# EAGLE board display-r2 (EAGLE 6.6.0), part 1 of 3
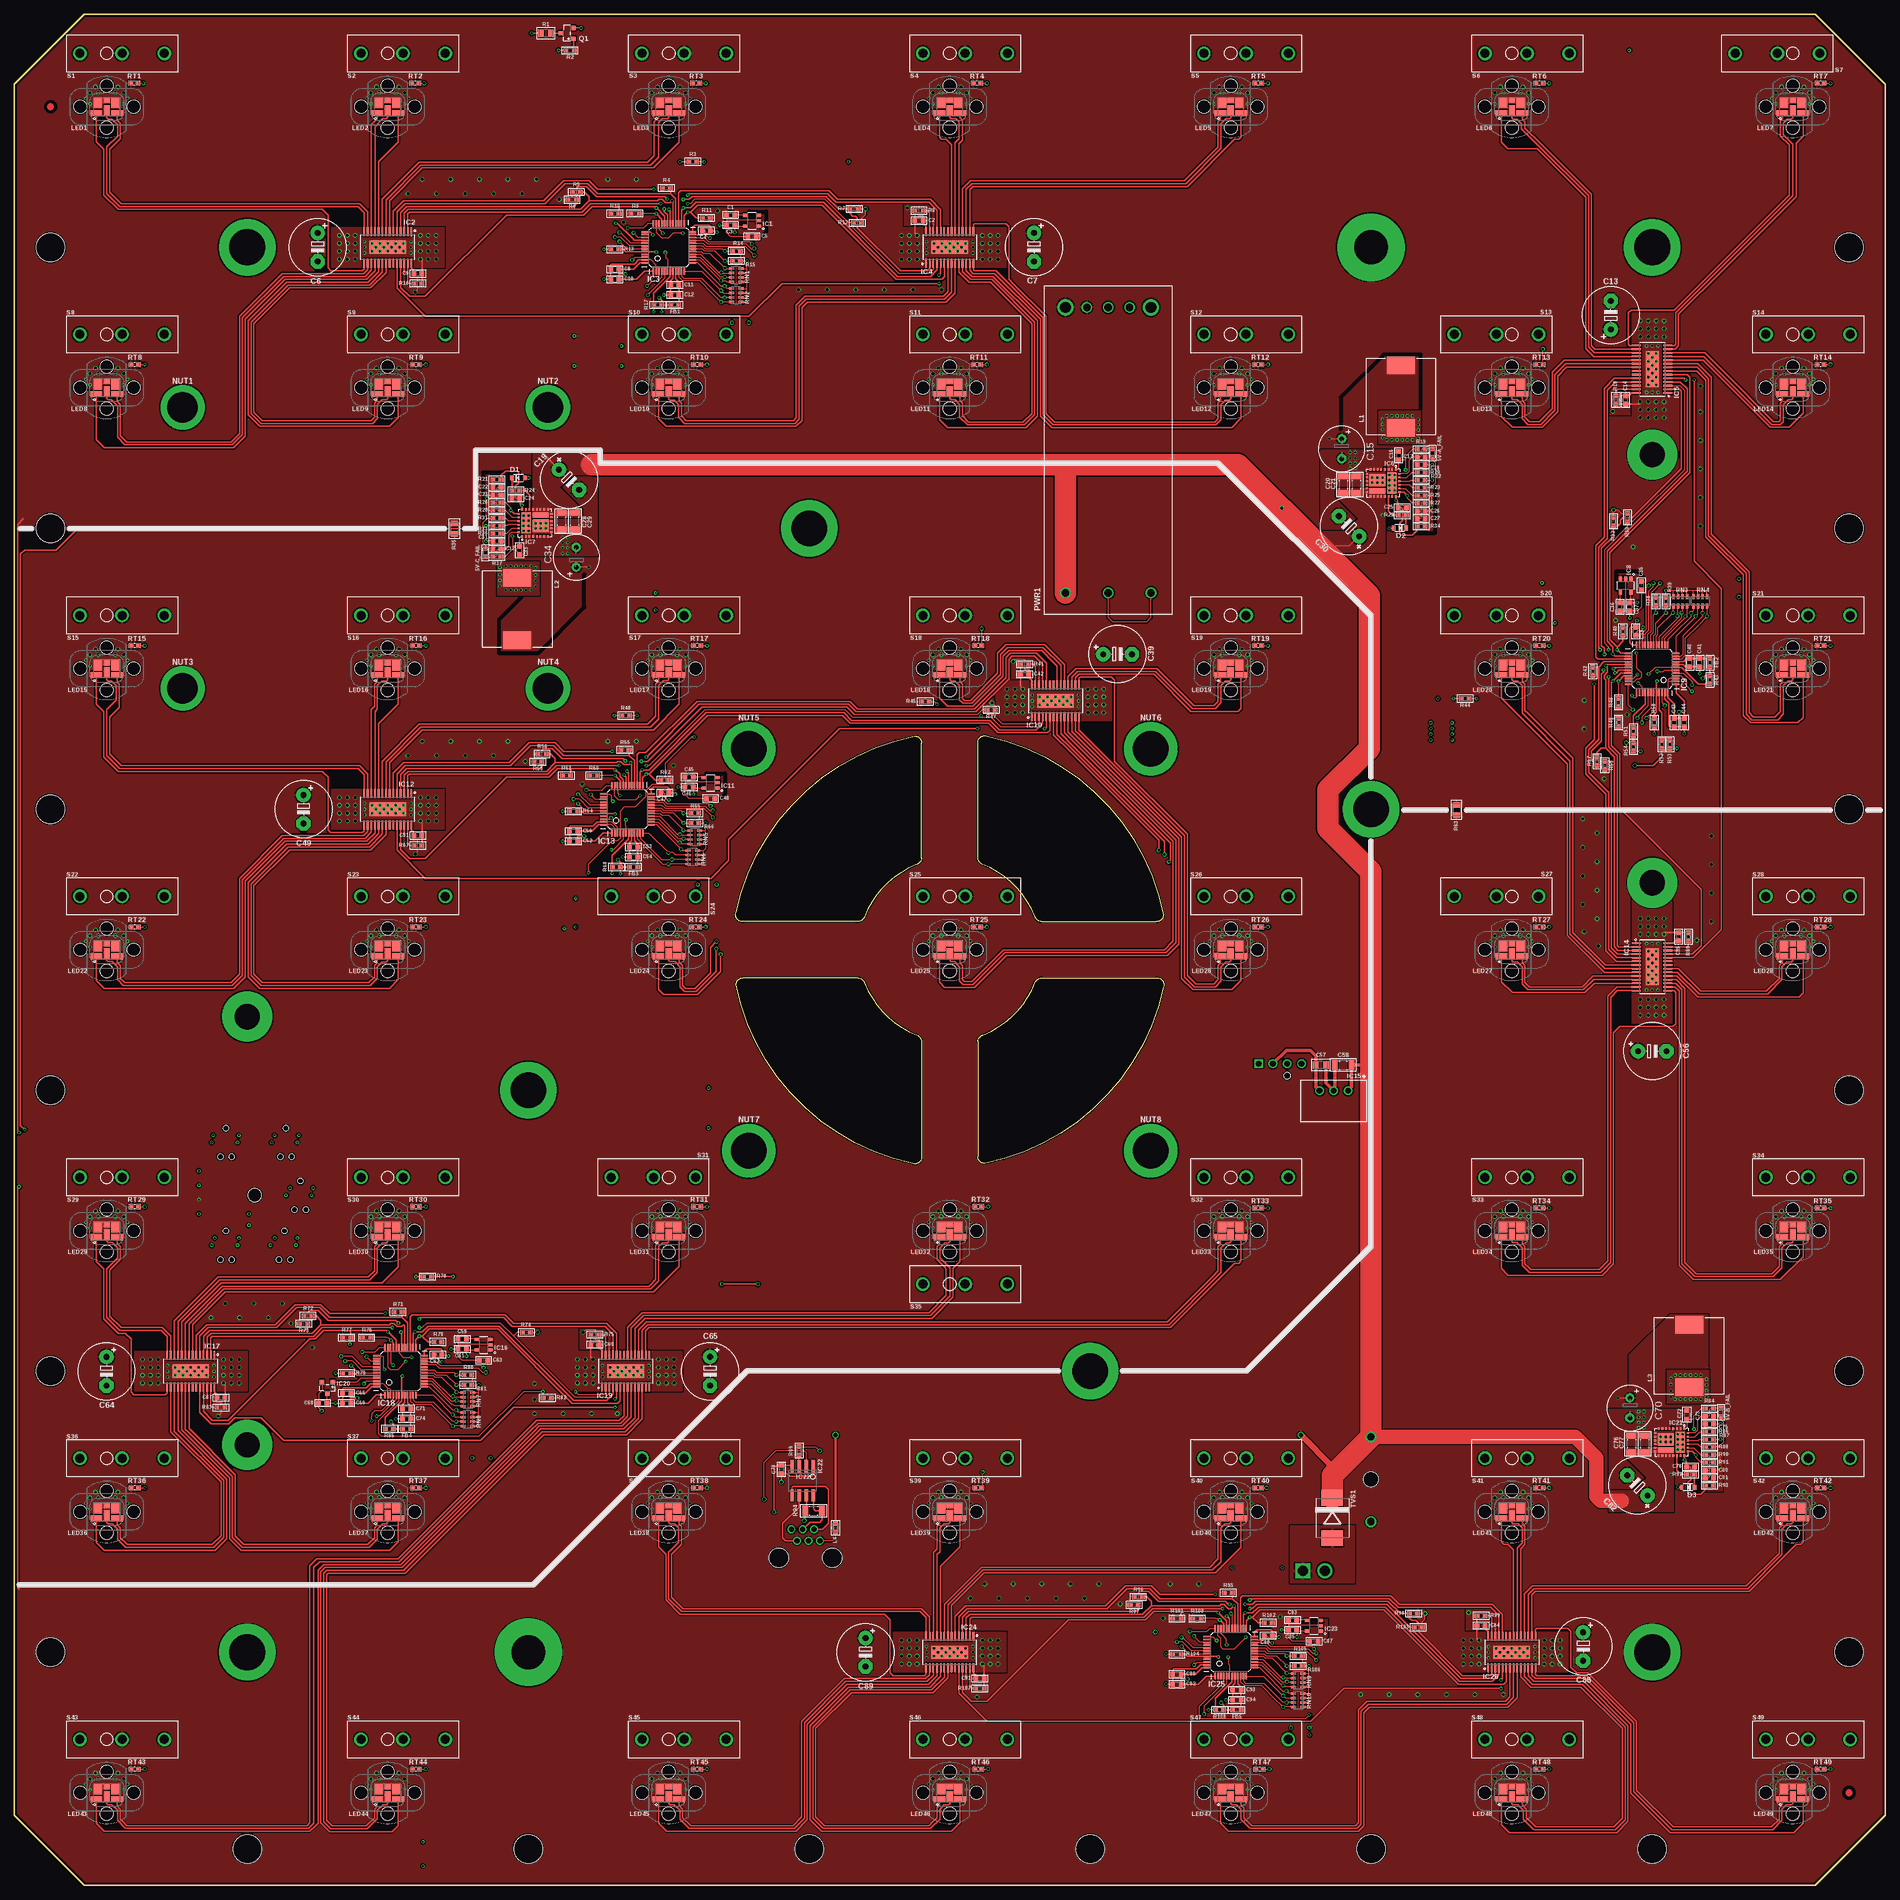
[diagram p9: board, top side]
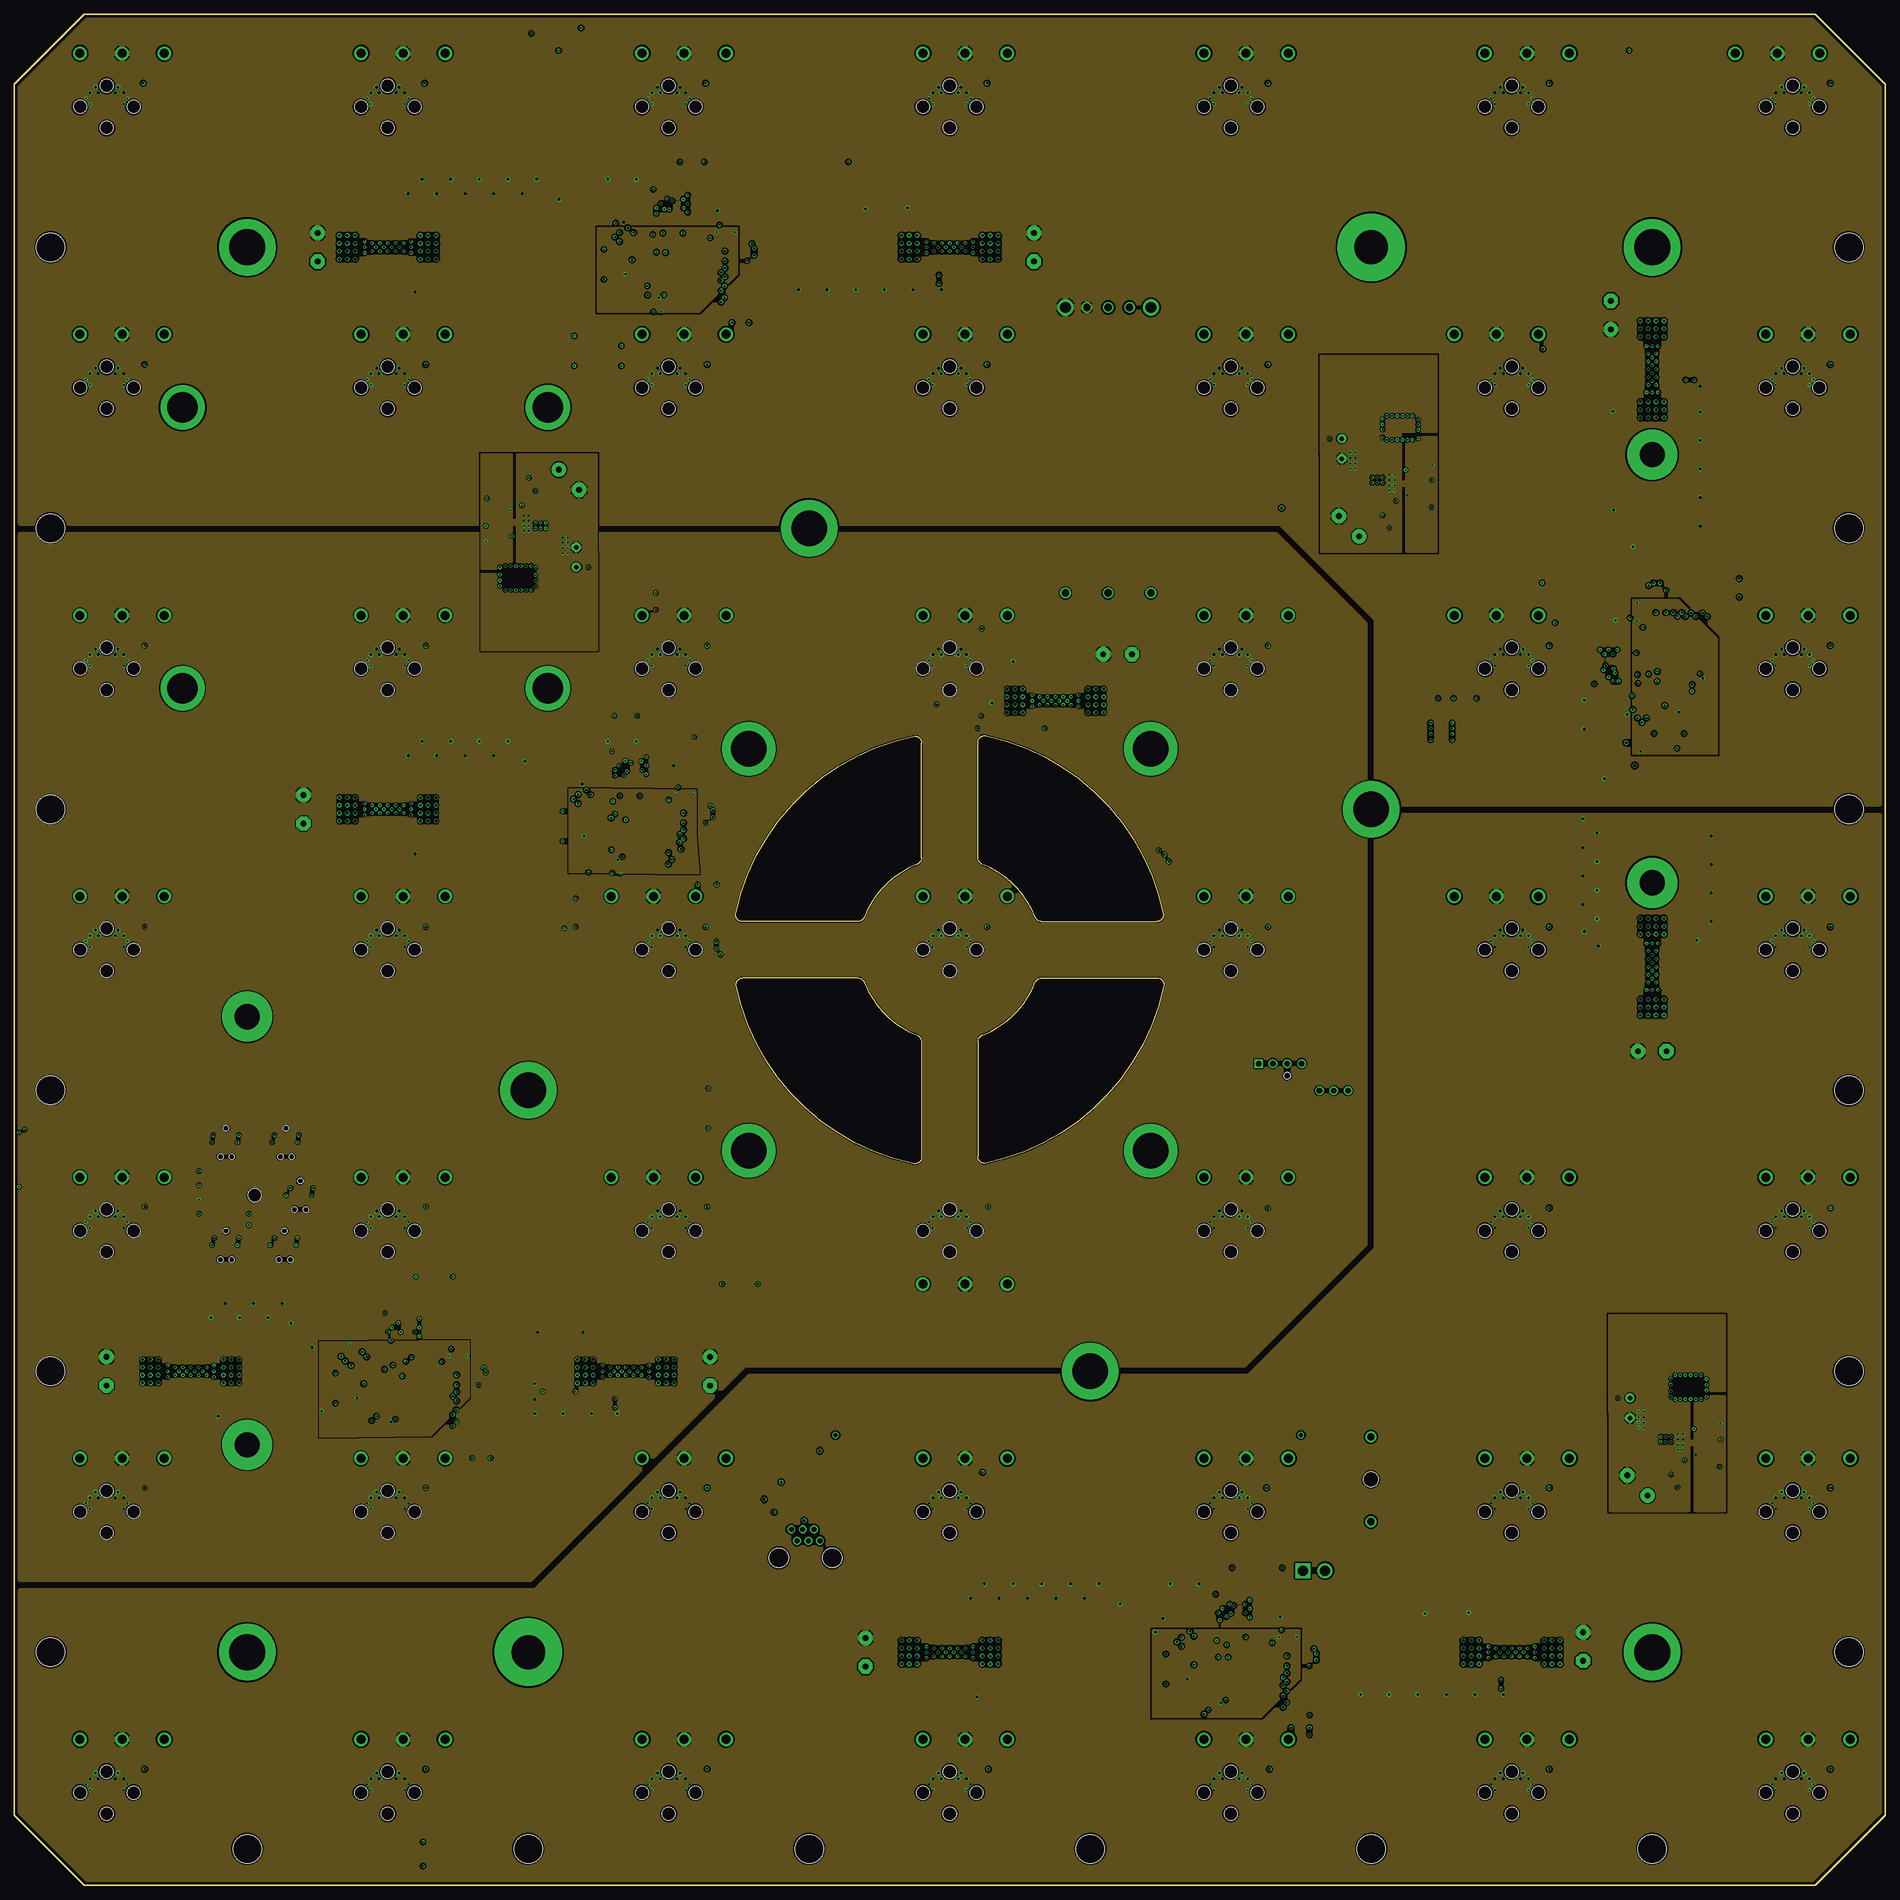
[diagram p10: board, inner layer Route2]
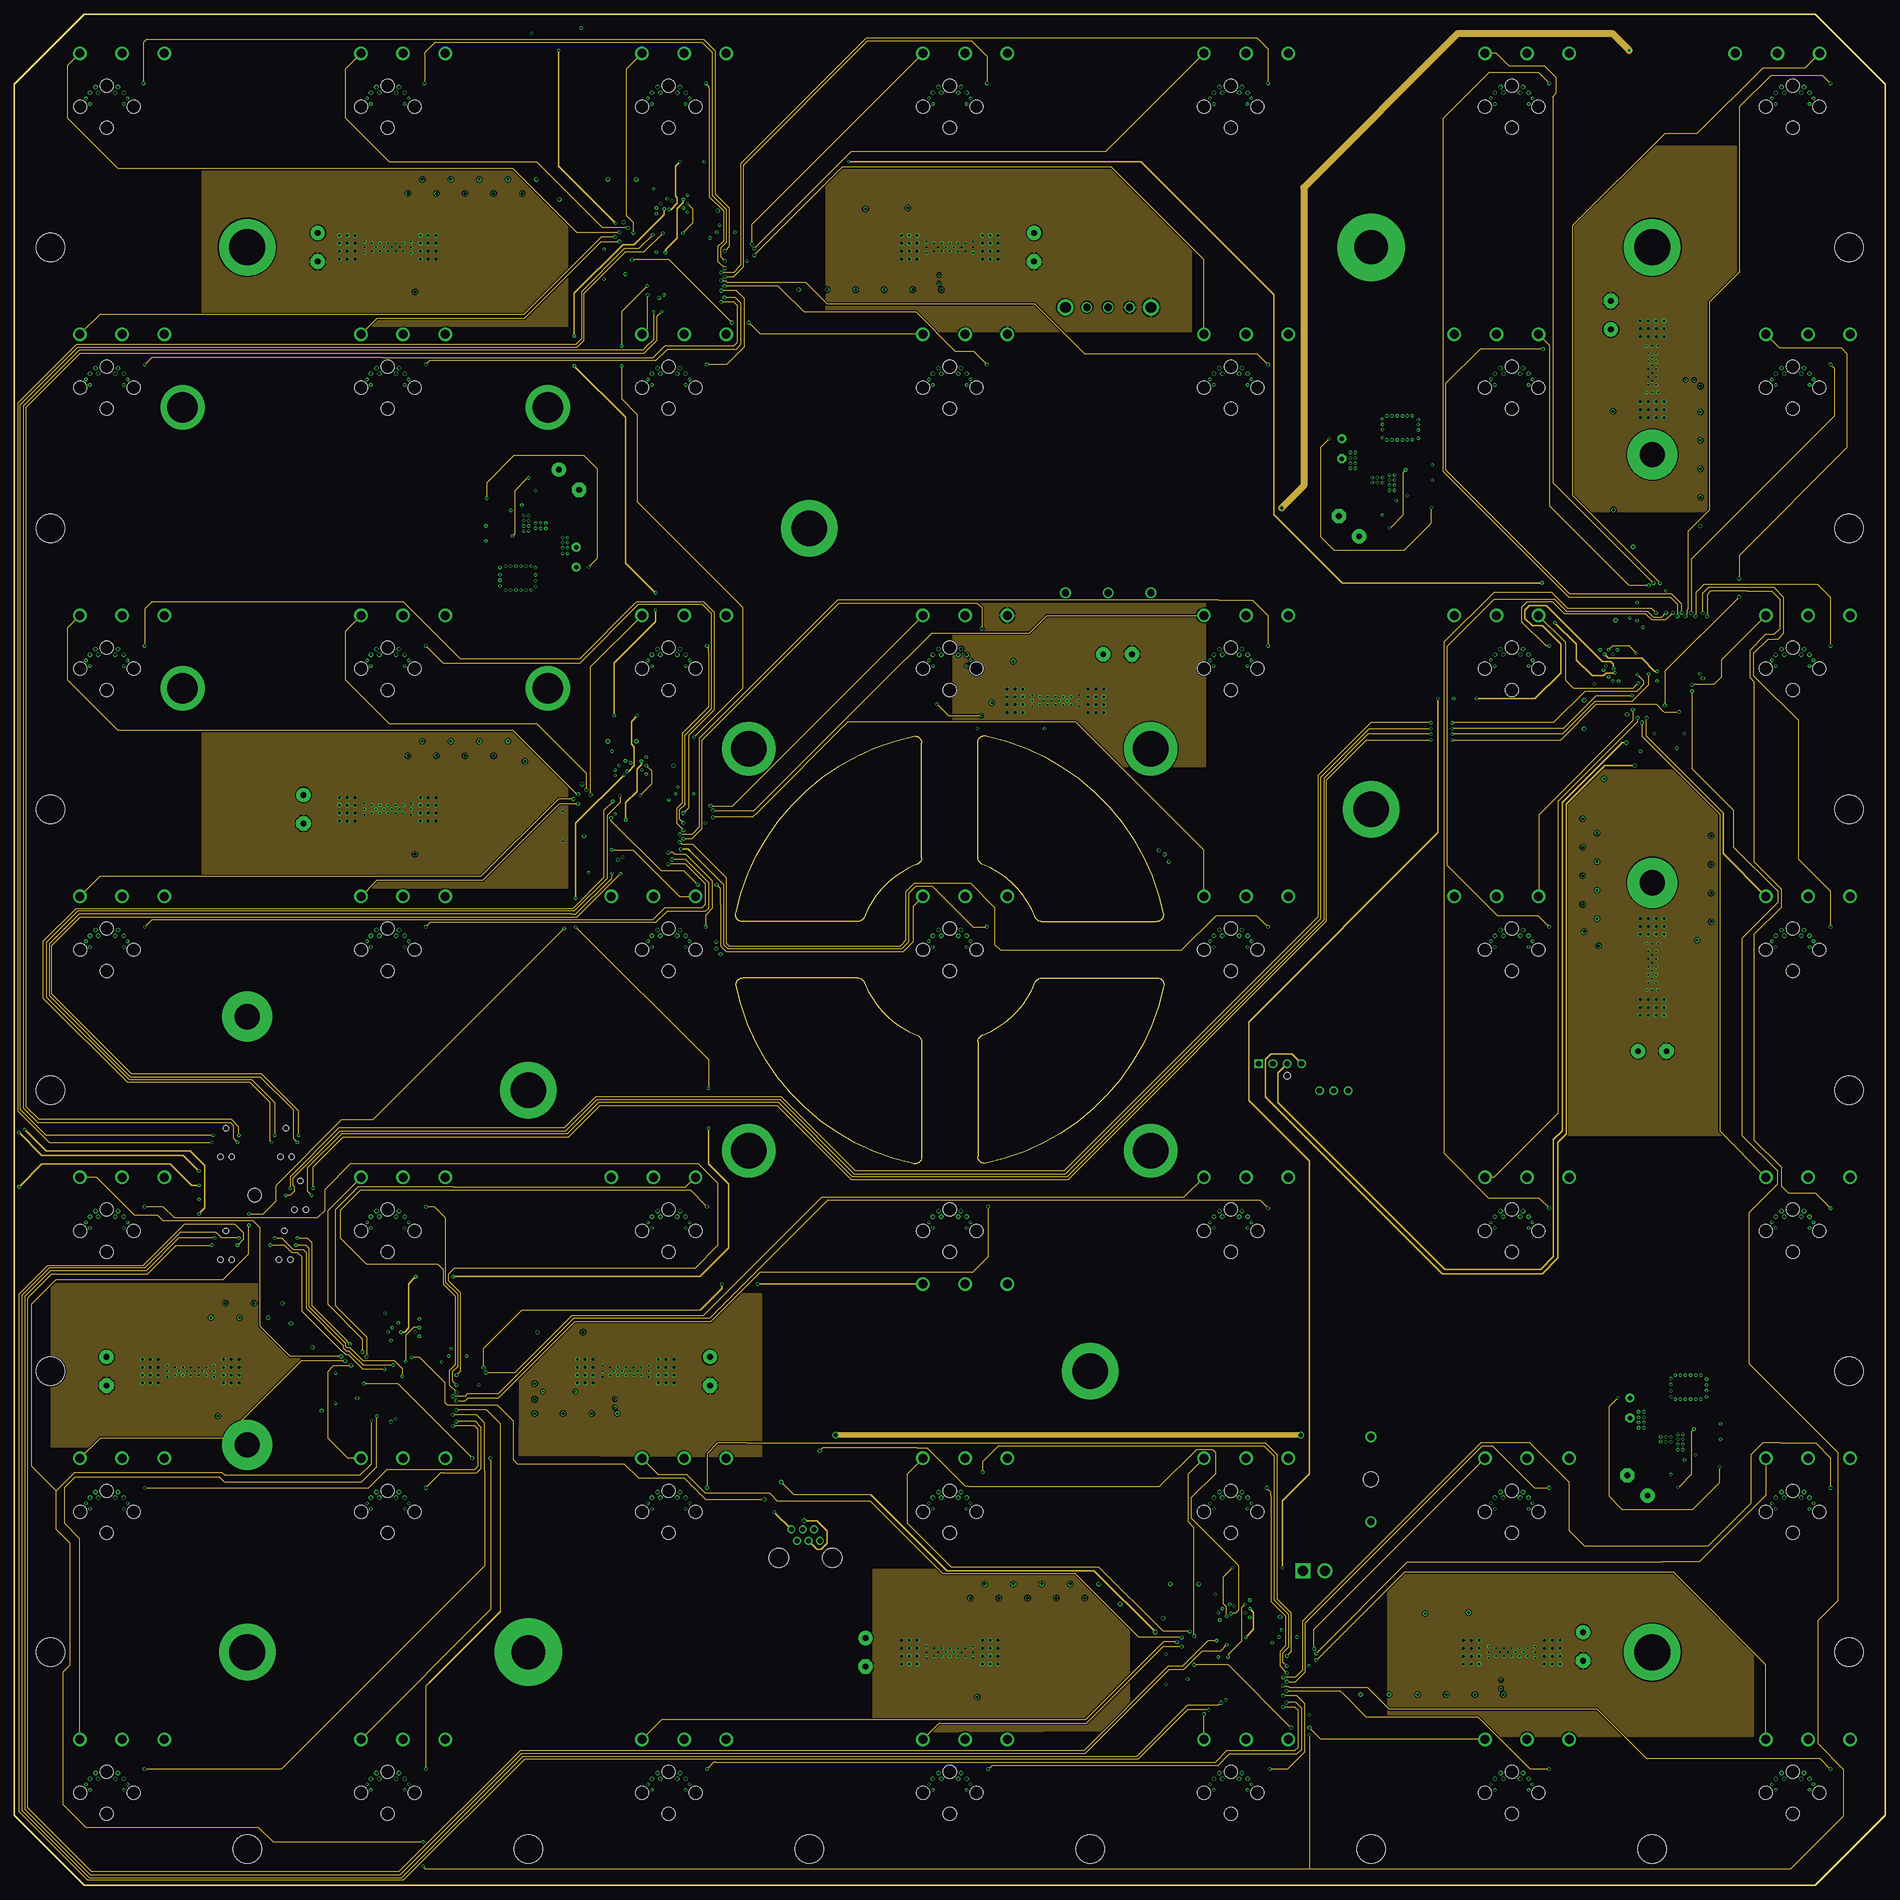
[diagram p11: board, inner layer Route3]
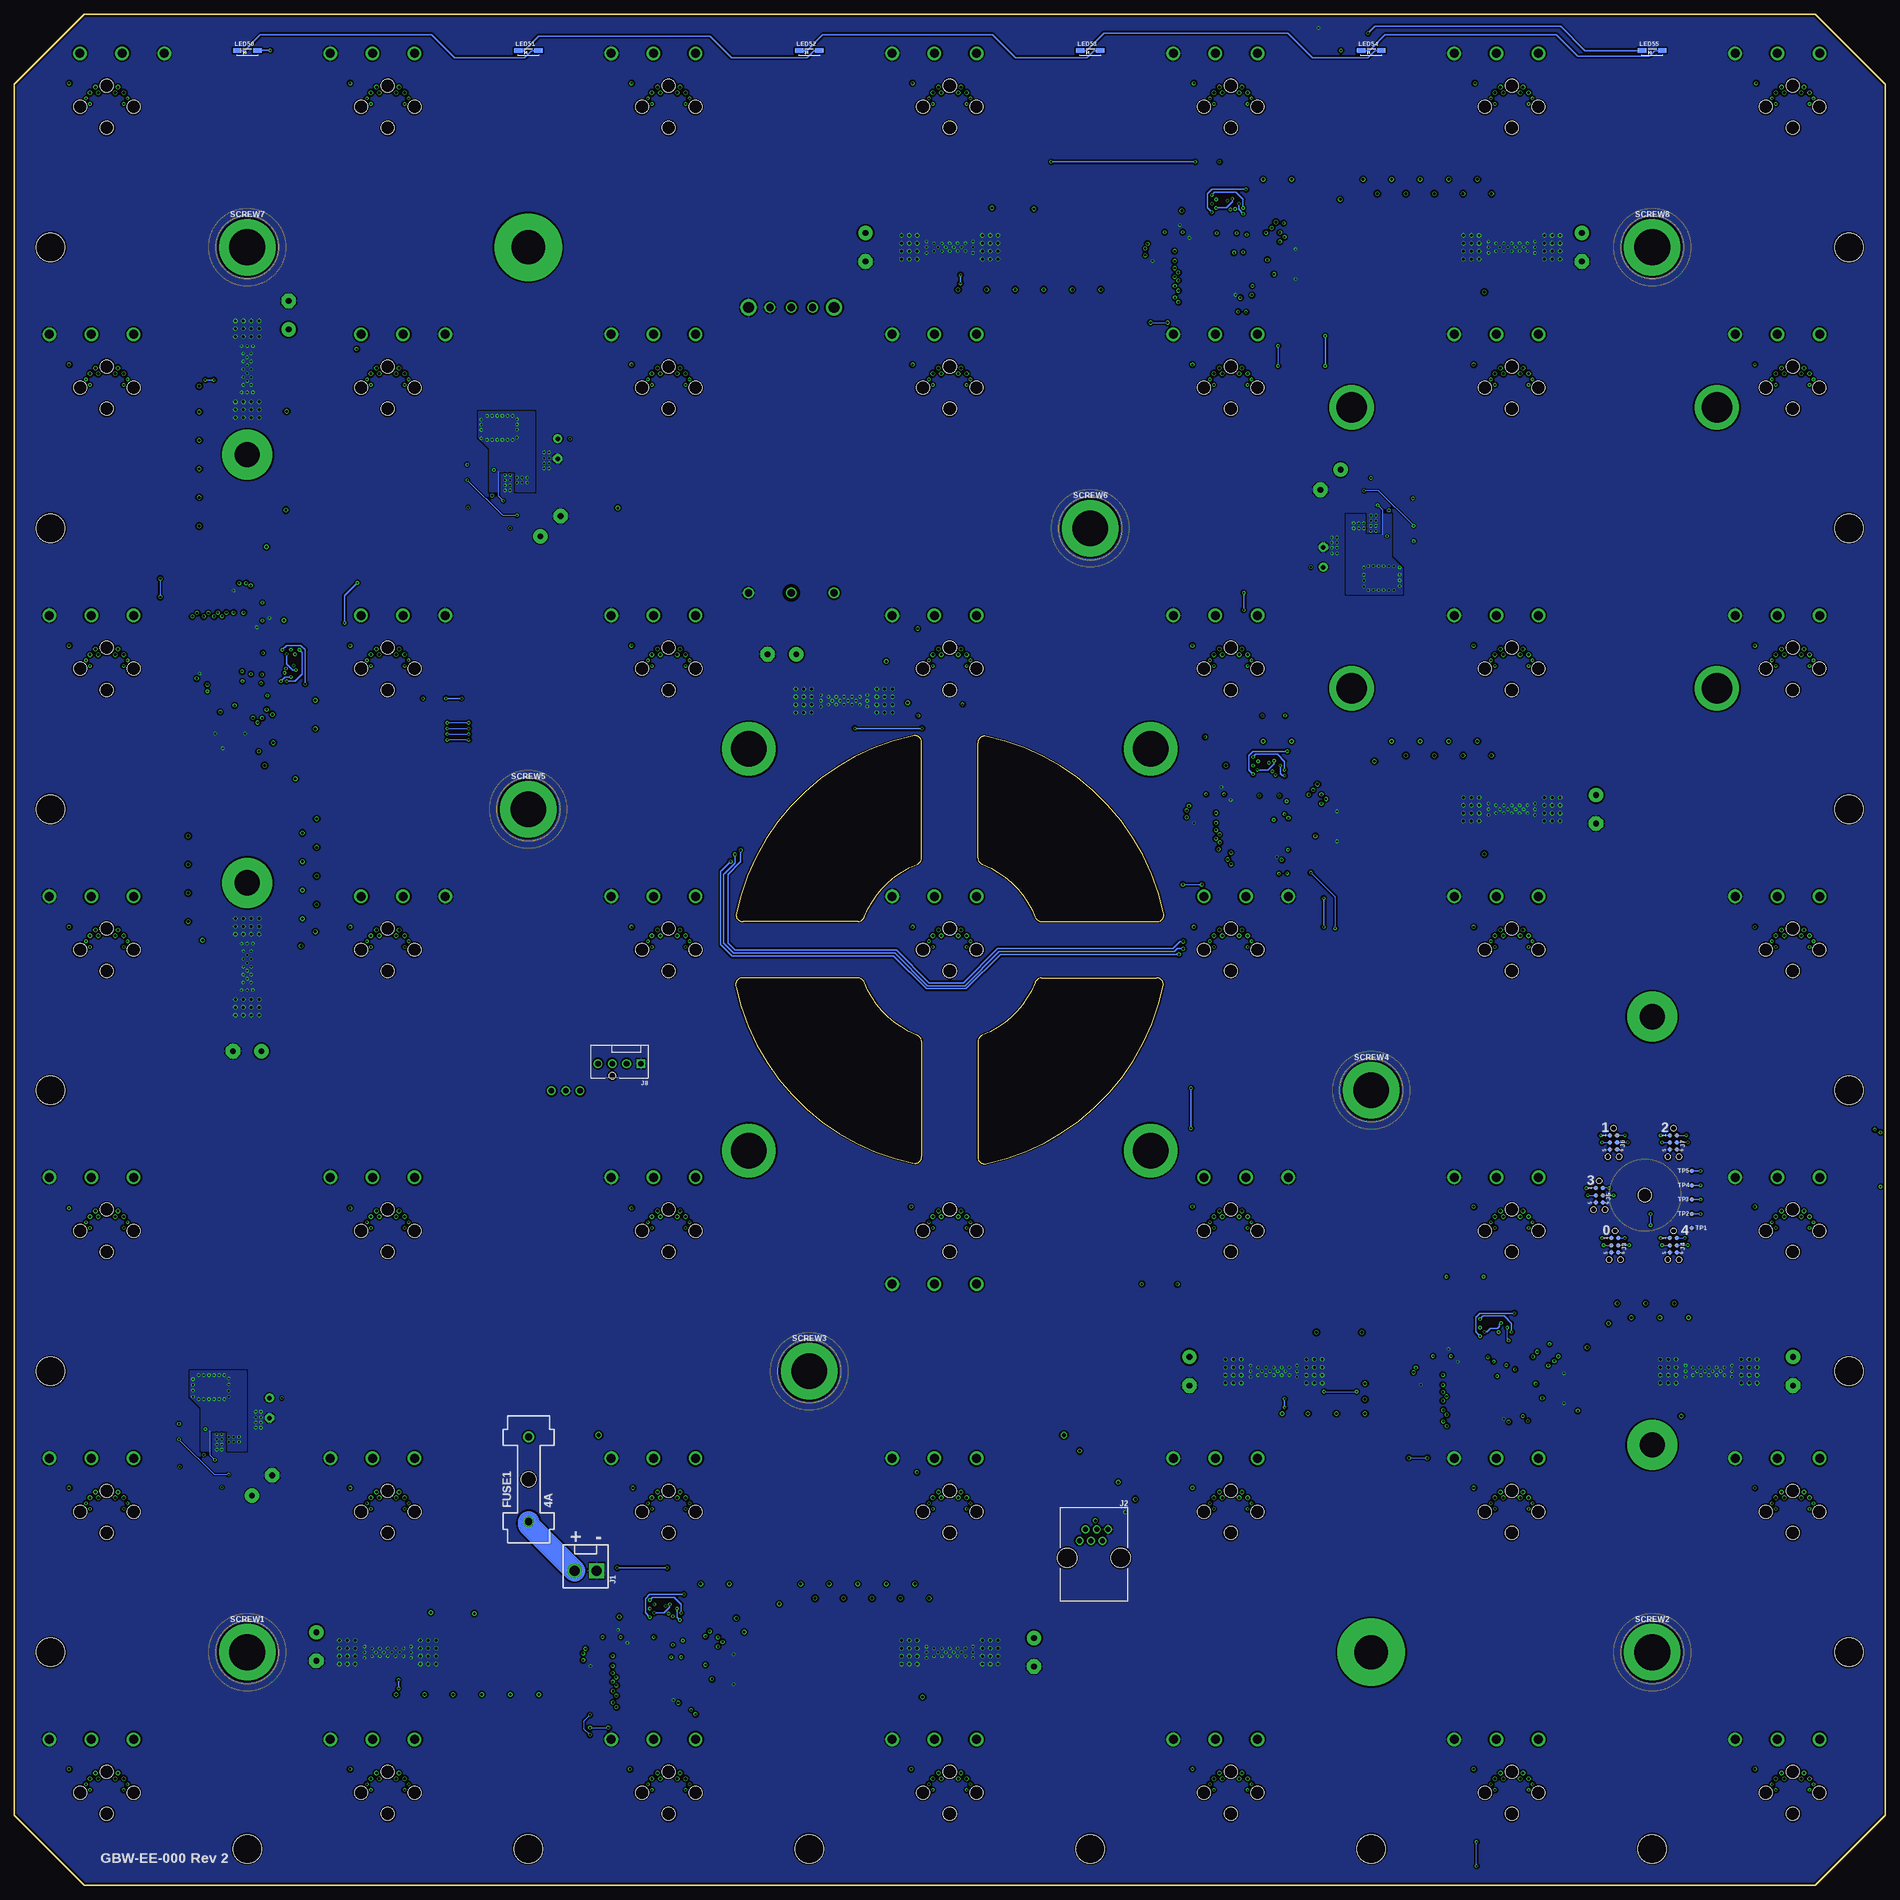
[diagram p12: board, bottom side, seen from below]

Size 333 x 333 mm. Coordinates in mm from the lower left corner, seen from the top.
Outline: 161.5,182.86 161.5,203.28 arc95 160.26,204.51 160.26,204.52 arc66 128.44,173.1 arc111 129.72,171.5 150.09,171.5 arc62 151.3,172.29 arc-46 160.55,181.66 arc76 161.5,182.86
Outline: 150.14,161.5 129.72,161.5 arc95 128.49,160.26 128.48,160.26 arc66 159.9,128.44 arc111 161.5,129.72 161.5,150.09 arc62 160.71,151.3 arc-46 151.34,160.55 arc76 150.14,161.5
Outline: 171.5,150.14 171.5,129.72 arc95 172.74,128.49 172.74,128.48 arc66 204.56,159.9 arc111 203.28,161.5 182.91,161.5 arc62 181.7,160.71 arc-46 172.45,151.34 arc76 171.5,150.14
Outline: 182.86,171.5 203.28,171.5 arc95 204.51,172.74 204.52,172.74 arc66 173.1,204.56 arc111 171.5,203.28 171.5,182.91 arc62 172.29,181.7 arc-46 181.66,172.45 arc76 182.86,171.5
Outline: 333,12.5 333,320.5 320.5,333 12.5,333 0,320.5 0,12.5 12.5,0 320.5,0 333,12.5
Copper layers (1+2*3+16): Top 0.042mm / dielectric 0.2mm / Route2 0.035mm / dielectric 1.1mm / Route3 0.035mm / dielectric 0.2mm / Bottom 0.042mm
Design rules "quickturnpcb.co.kr_4L_2.5oz *": minimum track width 8mil, minimum drill 12mil, track to track 8mil, track to pad 8mil, pad to pad 8mil, via to via 8mil, smd to smd 0mil, copper to edge 8mil, drill to drill 8mil, minimum pad ring 10mil, minimum via ring 5mil, stop-mask expansion 2mil, vias tented up to drill 20mil, thermal gap 10mil
Holes 5.08 mm at 6.5,291.5 6.5,241.5 6.5,191.5 6.5,141.5 6.5,91.5 6.5,41.5 41.5,6.5 91.5,6.5 141.5,6.5 191.5,6.5 241.5,6.5 291.5,6.5 326.5,41.5 326.5,91.5 326.5,141.5 326.5,191.5 326.5,241.5 326.5,291.5
Holes 2.38 mm at 42.8,122.81
tRestrict: area 5.7,315.7 to 7.3,317.3; area 325.4,15.4 to 327.6,17.6; 39 lines
bRestrict: area 193.6,228.9 to 195.8,231.1; area 247.5,246.9 to 248.4,247.8; area 251.9,252.4 to 252.8,253.2; area 298.9,76.2 to 299.6,77; area 303.2,81.7 to 304.1,82.6; area 87.9,244.2 to 88.8,245.1; area 83.5,238.8 to 84.4,239.6

## Footprints (pad centres in the part's own frame; a part is rotated, then mirrored left to right if it is on the bottom)
CHIPLED_0603 = smd 0.762 x 0.762: A 0,-0.737; C 0,0.737
C0603B = smd 0.813 x 0.914: 1 -0.737,0; 2 0.737,0
E5-10,5 = drill 1.016 pad 2.54: + -2.54,0 | drill 1.016 pad 2.54 octagon: - 2.54,0
E3,5-8 = drill 0.813 pad 1.6: + -1.778,0 | drill 0.813 pad 1.6 octagon: - 1.778,0
C1206NT = smd 1 x 1.8: 1 -1.5,0; 2 1.5,0
C0805B = smd 0.965 x 1.372: 1 -0.914,0; 2 0.914,0
C1206B = smd 1 x 1.8: 1 -1.5,0; 2 1.5,0
SOD-323 = smd 0.63 x 0.83: A 1.115,0; C -1.115,0
R0603B = smd 0.813 x 0.914: 1 -0.737,0; 2 0.737,0
649 = drill 1.295: 1 -7.544,0; 2 7.544,0 | hole 2.642: 0,0
SOT-23-5 = smd 0.55 x 0.8: 1 -0.95,-1.2; 2 0,-1.2; 3 0.95,-1.2; 4 0.95,1.2; 5 -0.95,1.2
TSSOP28_PAD = smd 0.3 x 1.6: 1 -4.225,-2.8; 2 -3.575,-2.8; 3 -2.925,-2.8; 4 -2.275,-2.8; 5 -1.625,-2.8; 6 -0.975,-2.8; 7 -0.325,-2.8; 8 0.325,-2.8; 9 0.975,-2.8; 10 1.625,-2.8; 11 2.275,-2.8; 12 2.925,-2.8; 13 3.575,-2.8; 14 4.225,-2.8; 15 4.225,2.8; 16 3.575,2.8; 17 2.925,2.8; 18 2.275,2.8; 19 1.625,2.8; 20 0.975,2.8; 21 0.325,2.8; 22 -0.325,2.8; 23 -0.975,2.8; 24 -1.625,2.8; 25 -2.275,2.8; 26 -2.925,2.8; 27 -3.575,2.8; 28 -4.225,2.8 | smd 6.46 x 2.35: PAD 0,0
LQFP-48 = smd 0.28 x 1.2: 1 -2.75,-4.25; 2 -2.25,-4.25; 3 -1.75,-4.25; 4 -1.25,-4.25; 5 -0.75,-4.25; 6 -0.25,-4.25; 7 0.25,-4.25; 8 0.75,-4.25; 9 1.25,-4.25; 10 1.75,-4.25; 11 2.25,-4.25; 12 2.75,-4.25; 25 2.75,4.25; 26 2.25,4.25; 27 1.75,4.25; 28 1.25,4.25; 29 0.75,4.25; 30 0.25,4.25; 31 -0.25,4.25; 32 -0.75,4.25; 33 -1.25,4.25; 34 -1.75,4.25; 35 -2.25,4.25; 36 -2.75,4.25 | smd 1.2 x 0.28: 13 4.25,-2.75; 14 4.25,-2.25; 15 4.25,-1.75; 16 4.25,-1.25; 17 4.25,-0.75; 18 4.25,-0.25; 19 4.25,0.25; 20 4.25,0.75; 21 4.25,1.25; 22 4.25,1.75; 23 4.25,2.25; 24 4.25,2.75; 37 -4.25,2.75; 38 -4.25,2.25; 39 -4.25,1.75; 40 -4.25,1.25; 41 -4.25,0.75; 42 -4.25,0.25; 43 -4.25,-0.25; 44 -4.25,-0.75; 45 -4.25,-1.25; 46 -4.25,-1.75; 47 -4.25,-2.25; 48 -4.25,-2.75
MLF28_5X6 = smd 0.4 x 0.3: 1 -2.4,2.275; 2 -2.4,1.625; 3 -2.4,0.975; 4 -2.4,0.325; 5 -2.4,-0.325; 6 -2.4,-0.975; 7 -2.4,-1.625; 8 -2.4,-2.275; 15 2.4,-2.275; 16 2.4,-1.625; 17 2.4,-0.975; 18 2.4,-0.325; 19 2.4,0.325; 20 2.4,0.975; 21 2.4,1.625; 22 2.4,2.275 | smd 0.3 x 0.4: 9 -1.625,-2.9; 10 -0.975,-2.9; 11 -0.325,-2.9; 12 0.325,-2.9; 13 0.975,-2.9; 14 1.625,-2.9; 23 1.625,2.9; 24 0.975,2.9; 25 0.325,2.9; 26 -0.325,2.9; 27 -0.975,2.9; 28 -1.625,2.9 | smd 3.7 x 1.6: PGND 0,1.55 | smd 0.9 x 2.83: PVIN 1.4,-1.015 | smd 2.2 x 2.83: SW -0.5,-1.015
P7805 = drill 1.016: 1 -2.54,0; 2 0,0; 3 2.54,0
SOT-23 = smd 0.8 x 0.9: 1 -0.95,-1; 2 0.95,-1; 3 0,1
SO08 = smd 0.6 x 2.2: 1 -1.905,-2.6; 2 -0.635,-2.6; 3 0.635,-2.6; 4 1.905,-2.6; 5 1.905,2.6; 6 0.635,2.6; 7 -0.635,2.6; 8 -1.905,2.6
640445-2 = drill 1.778 square: 1 -1.981,0 | drill 1.778: 2 1.981,0
RJE01-660-01 = drill 0.889: 1 2.54,5.08; 2 1.524,3.048; 3 0.508,5.08; 4 -0.508,3.048; 5 -1.524,5.08; 6 -2.54,3.048 | hole 3.454: -4.763,0; 4.763,0
TC2030-IDC-NL = smd 0.787 x 0.787: 1 1.27,-0.635; 2 1.27,0.635; 3 2.54,-0.635; 4 2.54,0.635; 5 3.81,-0.635; 6 3.81,0.635 | hole 0.991: 0,0; 5.08,1.016; 5.08,-1.016
47053 = drill 1.016 square: 1 5.08,0 | drill 1.016: 2 2.54,0; 3 0,0; 4 -2.54,0 | hole 1.25: 0,-2.16
SRP1265A = smd 3.1 x 5: 1 -5.55,0; 2 5.55,0
LRTB_C9TP-D = smd 1.5 x 2: A1 -1.55,0.7; A3 1.55,0.7 | smd 1.1 x 1.1: A2 0,1.15 | smd 2.1 x 1.1: C1 -1.85,-1.15; C3 1.85,-1.15 | smd 1.1 x 2: C2 0,-0.7 | hole 2.337: -4.763,0; 4.763,0 | hole 2.349: 0,3.75; 0,-3.75
LTW-006DCG = smd 1.5 x 0.85: A 1.8,0; K -1.8,0
SMTSO-632-2ET = drill 5.436 pad 7.874: P$1 0,0
SMTSO-832-2ET = drill 6.375 pad 9.525: 1 0,0
PWR-1/4-BRICK = drill 1.27: 1 3.81,19.05; 2 3.81,11.43; 3 3.81,3.81; 5 54.61,7.62; 6 54.61,11.43; 7 54.61,15.24 | drill 1.93: 4 54.61,3.81; 8 54.61,19.05
SOT-23' = smd 0.762 x 0.762: 1 -1.143,0.953; 2 -1.143,-0.953; 3 1.143,0
R0805B = smd 0.965 x 1.372: 1 -0.914,0; 2 0.914,0
R1206B = smd 1 x 1.8: 1 -1.5,0; 2 1.5,0
CAY16 = smd 0.9 x 0.425: A1 -0.85,1.2; A2 0.85,1.2; B1 -0.85,0.4; B2 0.85,0.4; C1 -0.85,-0.4; C2 0.85,-0.4; D1 -0.85,-1.2; D2 0.85,-1.2
R0603Y = smd 0.8 x 0.9: 1 -0.65,0; 2 0.65,0
DB2CC1AA = drill 1.6: 1 -4.77,0; 2 10.23,0; 4 2.73,0
SMTPR-6-1 = drill 6.35 pad 10.058: P$1 0,0
SMD_CIR30 = smd 0.762 x 0.762: P$1 0,0
SMC/DO214AB = smd 2.8 x 3.8: A 3.581,0; C -3.581,0

## Placement (x,y rotation side)
5V-A_FAIL  red  [CHIPLED_0603]  252.43,254.87 180 top
5V-B_FAIL  red  [CHIPLED_0603]  303.74,84.18 180 top
5V-C_FAIL  red  [CHIPLED_0603]  83.87,237.14 0 top
C1  .1uF  [C0603B]  127.5,297.23 0 top
C2  .1uF  [C0603B]  161.03,296.22 0 top
C3  10uF  [C0603B]  127.5,295.46 0 top
C4  .1uF  [C0603B]  123.18,294.44 0 top
C5  10uF  [C0603B]  131.31,293.42 0 top
C6  1000uF  [E5-10,5]  54.04,291.5 270 top
C7  1000uF  [E5-10,5]  181.5,291.5 270 top
C8  .1uF  [C0603B]  106.92,287.58 0 top
C9  .1uF  [C0603B]  71.87,286.82 180 top
C10  .1uF  [C0603B]  106.92,285.8 0 top
C11  .1uF  [C0603B]  117.59,284.79 0 top
C12  1uF  [C0603B]  117.59,283.01 0 top
C13  1000uF  [E5-10,5]  284.13,279.43 90 top
C14  .1uF  [C0603B]  286.78,264.33 90 top
C15  220uF  [E3,5-8]  236.25,255.65 270 top
C16  2.2uF  [C0603B]  246.36,254.43 270 top
C17  1uF  [C0603B]  250.37,254.18 180 top
C18  1uF  [C0603B]  250.37,252.81 0 top
C19  68uF  [E5-10,5]  98.75,250.14 315 top
C20  4.7uF  [C1206NT]  236.5,249.25 270 top
C21  4.7uF  [C1206NT]  238.84,249.25 270 top
C22  dnp  [C0603B]  85.93,248.8 180 top
C23  .1uF  [C0603B]  85.93,247.42 180 top
C24  .1uF  [C0603B]  89.28,246.81 180 top
C25  .1uF  [C0603B]  247.02,245.19 0 top
C26  .1uF  [C0603B]  250.37,244.58 0 top
C27  dnp  [C0603B]  250.37,243.21 0 top
C28  4.7uF  [C1206NT]  97.46,242.75 90 top
C29  4.7uF  [C1206NT]  99.8,242.75 90 top
C30  68uF  [E5-10,5]  237.55,241.87 135 top
C31  1uF  [C0603B]  85.93,239.19 180 top
C32  1uF  [C0603B]  85.93,237.82 0 top
C33  2.2uF  [C0603B]  89.94,237.57 90 top
C34  220uF  [E3,5-8]  100.05,236.35 90 top
C35  10uF  [C0603B]  289.58,231.31 90 top
C36  .1uF  [C0603B]  285.77,227.5 90 top
C37  10uF  [C0603B]  287.54,227.5 90 top
C38  .1uF  [C0603B]  288.56,223.18 90 top
C39  1000uF  [E5-10,5]  196.36,219.09 0 top
C40  .1uF  [C0603B]  298.21,217.59 90 top
C41  1uF  [C0603B]  299.99,217.59 90 top
C42  .1uF  [C0603B]  179.82,215.52 0 top
C43  .1uF  [C0603B]  295.42,206.92 90 top
C44  .1uF  [C0603B]  297.2,206.92 90 top
C45  .1uF  [C0603B]  120.13,197.23 0 top
C46  10uF  [C0603B]  120.13,195.46 0 top
C47  .1uF  [C0603B]  115.81,194.44 0 top
C48  10uF  [C0603B]  123.94,193.42 0 top
C49  1000uF  [E5-10,5]  51.5,191.5 270 top
C50  .1uF  [C0603B]  99.56,187.58 0 top
C51  .1uF  [C0603B]  71.87,186.82 180 top
C52  .1uF  [C0603B]  99.56,185.8 0 top
C53  .1uF  [C0603B]  110.23,184.79 0 top
C54  1uF  [C0603B]  110.23,183.01 0 top
C55  .1uF  [C0603B]  296.18,168.82 270 top
C56  1000uF  [E5-10,5]  291.5,148.45 0 top
C57  10uF 16v  [C0805B]  232.54,145.98 180 top
C58  10uF 50V  [C1206B]  236.5,145.98 0 top
C59  .1uF  [C0603B]  79.75,97.23 0 top
C60  .1uF  [C0603B]  103.37,96.22 0 top
C61  10uF  [C0603B]  79.75,95.46 0 top
C62  .1uF  [C0603B]  75.43,94.44 0 top
C63  10uF  [C0603B]  83.56,93.42 0 top
C64  1000uF  [E5-10,5]  16.45,91.5 270 top
C65  1000uF  [E5-10,5]  123.84,91.5 270 top
C66  .1uF  [C0603B]  59.17,87.58 0 top
C67  .1uF  [C0603B]  36.82,86.82 180 top
C68  .1uF  [C0603B]  54.92,85.8 180 top
C69  .1uF  [C0603B]  59.17,85.8 0 top
C70  220uF  [E3,5-8]  287.56,84.97 270 top
C71  .1uF  [C0603B]  69.84,84.79 0 top
C72  2.2uF  [C0603B]  297.67,83.75 270 top
C73  1uF  [C0603B]  301.68,83.49 180 top
C74  1uF  [C0603B]  69.84,83.01 0 top
C75  1uF  [C0603B]  301.68,82.12 0 top
C76  4.7uF  [C1206NT]  287.81,78.57 270 top
C77  4.7uF  [C1206NT]  290.15,78.57 270 top
C78  .1uF  [C0603B]  298.33,74.5 0 top
C79  .1uF  [C0603B]  136.53,74.04 270 top
C80  .1uF  [C0603B]  301.68,73.89 0 top
C81  dnp  [C0603B]  301.68,72.52 0 top
C82  68uF  [E5-10,5]  288.86,71.18 135 top
C83  .1uF  [C0603B]  227.5,47.23 0 top
C84  .1uF  [C0603B]  261.03,46.22 0 top
C85  10uF  [C0603B]  227.5,45.46 0 top
C86  .1uF  [C0603B]  223.18,44.44 0 top
C87  10uF  [C0603B]  231.31,43.42 0 top
C88  1000uF  [E5-10,5]  279.21,42.52 270 top
C89  1000uF  [E5-10,5]  151.5,41.5 270 top
C90  .1uF  [C0603B]  206.92,37.58 0 top
C91  .1uF  [C0603B]  171.87,36.82 180 top
C92  .1uF  [C0603B]  206.92,35.8 0 top
C93  .1uF  [C0603B]  217.59,34.79 0 top
C94  1uF  [C0603B]  217.59,33.01 0 top
D1  SD103AW  [SOD-323]  89.74,250.47 0 top
D2  SD103AW  [SOD-323]  246.56,241.53 180 top
D3  SD103AW  [SOD-323]  297.87,70.84 180 top
FB1  MMZ1608R102A  [R0603B]  117.59,281.23 180 top
FB2  MMZ1608R102A  [R0603B]  301.77,217.59 270 top
FB3  MMZ1608R102A  [R0603B]  110.23,181.23 180 top
FB4  MMZ1608R102A  [R0603B]  69.84,81.23 180 top
FB5  MMZ1608R102A  [R0603B]  217.59,31.23 180 top
FUSE1  4A  [649]  241.43,72.27 90 bottom
IC1  3.3V  [SOT-23-5]  131.31,296.22 90 top
IC2  TLC59401PWP  [TSSOP28_PAD]  66.5,291.5 180 top
IC3  STM32F030C8  [LQFP-48]  116.5,291.5 0 top
IC4  TLC59401PWP  [TSSOP28_PAD]  166.5,291.5 0 top
IC5  TLC59401PWP  [TSSOP28_PAD]  291.5,269.8 90 top
IC6  MIC26901  [MLF28_5X6]  243.61,249.56 270 top
IC7  MIC26901  [MLF28_5X6]  92.69,242.45 90 top
IC8  3.3V  [SOT-23-5]  286.78,231.31 180 top
IC9  STM32F030C8  [LQFP-48]  291.5,216.5 90 top
IC10  TLC59401PWP  [TSSOP28_PAD]  185.3,210.8 0 top
IC11  3.3V  [SOT-23-5]  123.94,196.22 90 top
IC12  TLC59401PWP  [TSSOP28_PAD]  66.5,191.5 180 top
IC13  STM32F030C8  [LQFP-48]  109.13,191.5 0 top
IC14  TLC59401PWP  [TSSOP28_PAD]  291.5,163.45 270 top
IC15  12V  [P7805]  234.83,141.4 180 top
IC16  3.3V  [SOT-23-5]  83.56,96.22 90 top
IC17  TLC59401PWP  [TSSOP28_PAD]  31.45,91.5 180 top
IC18  STM32F030C8  [LQFP-48]  68.75,91.5 0 top
IC19  TLC59401PWP  [TSSOP28_PAD]  108.84,91.5 0 top
IC20  DS2411R or 11AA02E48  [SOT-23]  55.76,88.52 180 top
IC21  MIC26901  [MLF28_5X6]  294.92,78.87 270 top
IC22  LTC2863  [SO08]  140.34,72.01 180 top
IC23  3.3V  [SOT-23-5]  231.31,46.22 90 top
IC24  TLC59401PWP  [TSSOP28_PAD]  166.5,41.5 180 top
IC25  STM32F030C8  [LQFP-48]  216.5,41.5 0 top
IC26  TLC59401PWP  [TSSOP28_PAD]  266.5,41.5 0 top
J1  1X2-MTA156  [640445-2]  231.3,56 180 bottom
J2  RJ12-JACK-RJE01  [RJE01-660-01]  140.85,58.3 0 bottom
J3  dnp  [TC2030-IDC-NL]  48.14,116.46 270 bottom
J4  dnp  [TC2030-IDC-NL]  37.72,116.46 270 bottom
J5  dnp  [TC2030-IDC-NL]  50.93,125.35 270 bottom
J6  dnp  [TC2030-IDC-NL]  48.39,134.75 270 bottom
J7  dnp  [TC2030-IDC-NL]  37.72,134.75 270 bottom
J8  COMP_FAN-47053  [47053]  226.55,146.24 0 bottom
L1  3.3uH  [SRP1265A]  246.76,264.9 90 top
L2  3.3uH  [SRP1265A]  89.54,227.1 270 top
L3  3.3uH  [SRP1265A]  298.07,94.21 90 top
L4  1000 Ohm  [R0603B]  146.18,63.63 270 top
LED1  LED_RGB-LRTB-D  [LRTB_C9TP-D]  16.5,316.5 0 top
LED2  LED_RGB-LRTB-D  [LRTB_C9TP-D]  66.5,316.5 0 top
LED3  LED_RGB-LRTB-D  [LRTB_C9TP-D]  116.5,316.5 0 top
LED4  LED_RGB-LRTB-D  [LRTB_C9TP-D]  166.5,316.5 0 top
LED5  LED_RGB-LRTB-D  [LRTB_C9TP-D]  216.5,316.5 0 top
LED6  LED_RGB-LRTB-D  [LRTB_C9TP-D]  266.5,316.5 0 top
LED7  LED_RGB-LRTB-D  [LRTB_C9TP-D]  316.5,316.5 0 top
LED8  LED_RGB-LRTB-D  [LRTB_C9TP-D]  16.5,266.5 0 top
LED9  LED_RGB-LRTB-D  [LRTB_C9TP-D]  66.5,266.5 0 top
LED10  LED_RGB-LRTB-D  [LRTB_C9TP-D]  116.5,266.5 0 top
LED11  LED_RGB-LRTB-D  [LRTB_C9TP-D]  166.5,266.5 0 top
LED12  LED_RGB-LRTB-D  [LRTB_C9TP-D]  216.5,266.5 0 top
LED13  LED_RGB-LRTB-D  [LRTB_C9TP-D]  266.5,266.5 0 top
LED14  LED_RGB-LRTB-D  [LRTB_C9TP-D]  316.5,266.5 0 top
LED15  LED_RGB-LRTB-D  [LRTB_C9TP-D]  16.5,216.5 0 top
LED16  LED_RGB-LRTB-D  [LRTB_C9TP-D]  66.5,216.5 0 top
LED17  LED_RGB-LRTB-D  [LRTB_C9TP-D]  116.5,216.5 0 top
LED18  LED_RGB-LRTB-D  [LRTB_C9TP-D]  166.5,216.5 0 top
LED19  LED_RGB-LRTB-D  [LRTB_C9TP-D]  216.5,216.5 0 top
LED20  LED_RGB-LRTB-D  [LRTB_C9TP-D]  266.5,216.5 0 top
LED21  LED_RGB-LRTB-D  [LRTB_C9TP-D]  316.5,216.5 0 top
LED22  LED_RGB-LRTB-D  [LRTB_C9TP-D]  16.5,166.5 0 top
LED23  LED_RGB-LRTB-D  [LRTB_C9TP-D]  66.5,166.5 0 top
LED24  LED_RGB-LRTB-D  [LRTB_C9TP-D]  116.5,166.5 0 top
LED25  LED_RGB-LRTB-D  [LRTB_C9TP-D]  166.5,166.5 0 top
LED26  LED_RGB-LRTB-D  [LRTB_C9TP-D]  216.5,166.5 0 top
LED27  LED_RGB-LRTB-D  [LRTB_C9TP-D]  266.5,166.5 0 top
LED28  LED_RGB-LRTB-D  [LRTB_C9TP-D]  316.5,166.5 0 top
LED29  LED_RGB-LRTB-D  [LRTB_C9TP-D]  16.5,116.5 0 top
LED30  LED_RGB-LRTB-D  [LRTB_C9TP-D]  66.5,116.5 0 top
LED31  LED_RGB-LRTB-D  [LRTB_C9TP-D]  116.5,116.5 0 top
LED32  LED_RGB-LRTB-D  [LRTB_C9TP-D]  166.5,116.5 0 top
LED33  LED_RGB-LRTB-D  [LRTB_C9TP-D]  216.5,116.5 0 top
LED34  LED_RGB-LRTB-D  [LRTB_C9TP-D]  266.5,116.5 0 top
LED35  LED_RGB-LRTB-D  [LRTB_C9TP-D]  316.5,116.5 0 top
LED36  LED_RGB-LRTB-D  [LRTB_C9TP-D]  16.5,66.5 0 top
LED37  LED_RGB-LRTB-D  [LRTB_C9TP-D]  66.5,66.5 0 top
LED38  LED_RGB-LRTB-D  [LRTB_C9TP-D]  116.5,66.5 0 top
LED39  LED_RGB-LRTB-D  [LRTB_C9TP-D]  166.5,66.5 0 top
LED40  LED_RGB-LRTB-D  [LRTB_C9TP-D]  216.5,66.5 0 top
LED41  LED_RGB-LRTB-D  [LRTB_C9TP-D]  266.5,66.5 0 top
LED42  LED_RGB-LRTB-D  [LRTB_C9TP-D]  316.5,66.5 0 top
LED43  LED_RGB-LRTB-D  [LRTB_C9TP-D]  16.5,16.5 0 top
LED44  LED_RGB-LRTB-D  [LRTB_C9TP-D]  66.5,16.5 0 top
LED45  LED_RGB-LRTB-D  [LRTB_C9TP-D]  116.5,16.5 0 top
LED46  LED_RGB-LRTB-D  [LRTB_C9TP-D]  166.5,16.5 0 top
LED47  LED_RGB-LRTB-D  [LRTB_C9TP-D]  216.5,16.5 0 top
LED48  LED_RGB-LRTB-D  [LRTB_C9TP-D]  266.5,16.5 0 top
LED49  LED_RGB-LRTB-D  [LRTB_C9TP-D]  316.5,16.5 0 top
LED50  [LTW-006DCG]  291.5,326.5 0 bottom
LED51  [LTW-006DCG]  241.5,326.5 0 bottom
LED52  [LTW-006DCG]  191.5,326.5 0 bottom
LED53  [LTW-006DCG]  141.5,326.5 0 bottom
LED54  [LTW-006DCG]  91.5,326.5 0 bottom
LED55  [LTW-006DCG]  41.5,326.5 0 bottom
NUT1  NUTSMTSO-632  [SMTSO-632-2ET]  30,263 0 top
NUT2  NUTSMTSO-632  [SMTSO-632-2ET]  95,263 0 top
NUT3  NUTSMTSO-632  [SMTSO-632-2ET]  30,213 0 top
NUT4  NUTSMTSO-632  [SMTSO-632-2ET]  95,213 0 top
NUT5  NUTSMTSO-832  [SMTSO-832-2ET]  130.75,202.25 0 top
NUT6  NUTSMTSO-832  [SMTSO-832-2ET]  202.25,202.25 0 top
NUT7  NUTSMTSO-832  [SMTSO-832-2ET]  130.75,130.75 0 top
NUT8  NUTSMTSO-832  [SMTSO-832-2ET]  202.25,130.75 0 top
PWR1  dnp  [PWR-1/4-BRICK]  206.12,226.19 90 top
Q1  NFET-2N7002P,215-SOT23  [SOT-23']  98.43,329.57 180 top
R1  274R  [R0805B]  94.62,329.57 180 top
R2  2k2  [R0603B]  98.94,326.52 180 top
R3  47R5  [R0603B]  120.78,306.71 0 top
R4  10k  [R0603B]  116.07,302.06 180 top
R5  10k  [R0603B]  100.06,301.33 180 top
R6  10k  [R0603B]  99.3,299.95 180 top
R7  10k  [R0603B]  149.48,298.33 0 top
R8  324R  [R0603B]  161.03,298 0 top
R9  10k  [R0603B]  110.5,297.5 180 top
R10  10k  [R0603B]  106.92,297.49 180 top
R11  10k  [R0603B]  123.18,296.73 0 top
R12  10k  [R0603B]  150.04,295.84 0 top
R13  10k  [R0603B]  106.92,291.14 180 top
R14  2k2  [R0603B]  128.51,290.83 0 top
R15  2k2  [R0603B]  128.51,289.06 0 top
R16  324R  [R0603B]  71.87,285.04 180 top
R17  10k  [R0603B]  114.54,281.23 0 top
R18  324R  [R0603B]  285,264.33 90 top
R19  1R5  [R0603B]  250.37,255.55 0 top
R20  1R5  [R0603B]  250.37,251.44 180 top
R21  dnp  [R0603B]  85.93,250.17 180 top
R22  10k  [R0603B]  250.37,250.07 0 top
R23  10k  [R0603B]  250.37,248.69 0 top
R24  1R5  [R0603B]  89.28,248.19 180 top
R25  2k49  [R0603B]  250.37,247.32 0 top
R26  475R  [R0603B]  85.93,246.05 180 top
R27  475R  [R0603B]  250.37,245.95 0 top
R28  2k49  [R0603B]  85.93,244.68 180 top
R29  1R5  [R0603B]  247.02,243.82 0 top
R30  10k  [R0603B]  287.1,243.41 90 top
R31  10k  [R0603B]  85.93,243.31 180 top
R32  10k  [R0603B]  284.61,242.7 90 top
R33  10k  [R0603B]  85.93,241.94 180 top
R34  dnp  [R0603B]  250.37,241.84 0 top
R35  dnp  [R0805B]  78.36,241.43 270 top
R36  1R5  [R0603B]  85.93,240.57 0 top
R37  1R5  [R0603B]  85.93,236.45 180 top
R38  2k2  [R0603B]  292.17,228.51 90 top
R39  2k2  [R0603B]  293.94,228.51 90 top
R40  10k  [R0603B]  286.27,223.18 90 top
R41  324R  [R0603B]  179.82,217.3 0 top
R42  10k  [R0603B]  280.94,216.07 270 top
R43  10k  [R0603B]  301.77,214.54 90 top
R44  47R5  [R0603B]  258.19,211.2 180 top
R45  10k  [R0603B]  162.13,210.65 180 top
R46  10k  [R0603B]  285.5,210.5 270 top
R47  10k  [R0603B]  173.87,209.17 0 top
R48  47R5  [R0603B]  108.84,208.16 180 top
R49  10k  [R0603B]  285.51,206.92 270 top
R50  10k  [R0603B]  291.86,206.92 270 top
R51  4k75  [R0603B]  288.17,205.36 270 top
R52  4k75  [R0603B]  293.25,203.08 270 top
R53  dnp  [R0603B]  294.62,203.08 90 top
R54  4k75  [R0603B]  288.17,202.62 270 top
R55  10k  [R0603B]  108.7,202.06 180 top
R56  10k  [R0603B]  93.96,201.33 180 top
R57  10k  [R0603B]  281.67,200.06 270 top
R58  10k  [R0603B]  93.21,199.95 180 top
R59  10k  [R0603B]  283.05,199.3 270 top
R60  10k  [R0603B]  103.13,197.5 180 top
R61  10k  [R0603B]  98.29,197.49 180 top
R62  10k  [R0603B]  115.81,196.73 0 top
R63  dnp  [R0805B]  256.67,191.39 270 top
R64  10k  [R0603B]  99.56,191.14 180 top
R65  2k2  [R0603B]  121.15,190.83 0 top
R66  2k2  [R0603B]  121.15,189.06 0 top
R67  324R  [R0603B]  71.87,185.04 180 top
R68  10k  [R0603B]  107.18,181.23 0 top
R69  324R  [R0603B]  297.96,168.82 270 top
R70  47R5  [R0603B]  73.54,108.33 0 top
R71  10k  [R0603B]  68.32,102.06 180 top
R72  10k  [R0603B]  52.31,101.33 180 top
R73  10k  [R0603B]  51.55,99.95 180 top
R74  10k  [R0603B]  91.16,98.43 0 top
R75  324R  [R0603B]  103.37,98 0 top
R76  10k  [R0603B]  62.75,97.5 180 top
R77  10k  [R0603B]  59.17,97.49 180 top
R78  10k  [R0603B]  75.43,96.73 0 top
R79  10k  [R0603B]  59.17,91.14 180 top
R80  2k2  [R0603B]  80.76,90.83 0 top
R81  2k2  [R0603B]  80.76,89.06 0 top
R82  10k  [R0603B]  94.87,86.74 0 top
R83  324R  [R0603B]  36.82,85.04 180 top
R84  1R5  [R0603B]  301.68,84.86 0 top
R85  10k  [R0603B]  66.79,81.23 0 top
R86  1R5  [R0603B]  301.68,80.75 180 top
R87  10k  [R0603B]  301.68,79.38 0 top
R88  10k  [R0603B]  301.68,78.01 0 top
R89  47R5  [R0603B]  139.7,77.35 270 top
R90  2k49  [R0603B]  301.68,76.63 0 top
R91  475R  [R0603B]  301.68,75.26 0 top
R92  1R5  [R0603B]  298.33,73.13 0 top
R93  dnp  [R0603B]  301.68,71.15 0 top
R94  120R  [R1206B]  142.27,66.68 0 top
R95  10k  [R0603B]  216.07,52.06 180 top
R96  10k  [R0603B]  200.06,51.33 180 top
R97  10k  [R0603B]  199.3,49.95 180 top
R98  10k  [R0603B]  249.05,48.39 0 top
R99  324R  [R0603B]  261.03,48 0 top
R100  10k  [R0603B]  210.5,47.5 180 top
R101  10k  [R0603B]  206.92,47.49 180 top
R102  10k  [R0603B]  223.18,46.73 0 top
R103  10k  [R0603B]  249.86,45.93 0 top
R104  10k  [R0603B]  206.92,41.14 180 top
R105  2k2  [R0603B]  228.51,40.83 0 top
R106  2k2  [R0603B]  228.51,39.06 0 top
R107  324R  [R0603B]  171.87,35.04 180 top
R108  10k  [R0603B]  214.54,31.23 0 top
RN1  2k2  [CAY16]  128.51,286.52 0 top
RN2  2k2  [CAY16]  128.51,282.96 0 top
RN3  2k2  [CAY16]  296.48,228.51 90 top
RN4  2k2  [CAY16]  300.04,228.51 90 top
RN5  2k2  [CAY16]  121.15,186.52 0 top
RN6  2k2  [CAY16]  120.75,182.96 0 top
RN7  2k2  [CAY16]  80.76,86.52 0 top
RN8  2k2  [CAY16]  80.76,82.96 0 top
RN9  2k2  [CAY16]  228.51,36.52 0 top
RN10  2k2  [CAY16]  228.51,32.96 0 top
RT1  10k  [R0603Y]  21.37,320.69 180 top
RT2  10k  [R0603Y]  71.37,320.69 180 top
RT3  10k  [R0603Y]  121.37,320.69 180 top
RT4  10k  [R0603Y]  171.33,320.68 180 top
RT5  10k  [R0603Y]  221.36,320.68 180 top
RT6  10k  [R0603Y]  271.4,320.68 180 top
RT7  10k  [R0603Y]  321.44,320.68 180 top
RT8  10k  [R0603Y]  21.47,270.64 180 top
RT9  10k  [R0603Y]  71.5,270.64 180 top
RT10  10k  [R0603Y]  121.54,270.64 180 top
RT11  10k  [R0603Y]  171.33,270.64 180 top
RT12  10k  [R0603Y]  221.36,270.64 180 top
RT13  10k  [R0603Y]  271.4,270.64 180 top
RT14  10k  [R0603Y]  321.44,270.64 180 top
RT15  10k  [R0603Y]  21.47,220.6 180 top
RT16  10k  [R0603Y]  71.5,220.6 180 top
RT17  10k  [R0603Y]  121.54,220.6 180 top
RT18  10k  [R0603Y]  171.58,220.6 180 top
RT19  10k  [R0603Y]  221.36,220.6 180 top
RT20  10k  [R0603Y]  271.4,220.6 180 top
RT21  10k  [R0603Y]  321.44,220.6 180 top
RT22  10k  [R0603Y]  21.47,170.56 180 top
RT23  10k  [R0603Y]  71.5,170.56 180 top
RT24  10k  [R0603Y]  121.29,170.56 180 top
RT25  10k  [R0603Y]  171.33,170.56 180 top
RT26  10k  [R0603Y]  221.36,170.56 180 top
RT27  10k  [R0603Y]  271.4,170.56 180 top
RT28  10k  [R0603Y]  321.44,170.56 180 top
RT29  10k  [R0603Y]  21.47,120.78 180 top
RT30  10k  [R0603Y]  71.5,120.78 180 top
RT31  10k  [R0603Y]  121.54,120.78 180 top
RT32  10k  [R0603Y]  171.58,120.78 180 top
RT33  10k  [R0603Y]  221.36,120.53 180 top
RT34  10k  [R0603Y]  271.4,120.53 180 top
RT35  10k  [R0603Y]  321.44,120.53 180 top
RT36  10k  [R0603Y]  21.47,70.74 180 top
RT37  10k  [R0603Y]  71.5,70.74 180 top
RT38  10k  [R0603Y]  121.54,70.74 180 top
RT39  10k  [R0603Y]  171.58,70.74 180 top
RT40  10k  [R0603Y]  221.36,70.74 180 top
RT41  10k  [R0603Y]  271.4,70.74 180 top
RT42  10k  [R0603Y]  321.44,70.74 180 top
RT43  10k  [R0603Y]  21.47,20.7 180 top
RT44  10k  [R0603Y]  71.5,20.7 180 top
RT45  10k  [R0603Y]  121.54,20.7 180 top
RT46  10k  [R0603Y]  171.58,20.7 180 top
RT47  10k  [R0603Y]  221.62,20.7 180 top
RT48  10k  [R0603Y]  271.4,20.7 180 top
RT49  10k  [R0603Y]  321.44,20.7 180 top
S1  SPDTDB2CC1AA  [DB2CC1AA]  16.5,326 0 top
S2  SPDTDB2CC1AA  [DB2CC1AA]  66.5,326 0 top
S3  SPDTDB2CC1AA  [DB2CC1AA]  116.5,326 0 top
S4  SPDTDB2CC1AA  [DB2CC1AA]  166.5,326 0 top
S5  SPDTDB2CC1AA  [DB2CC1AA]  216.5,326 0 top
S6  SPDTDB2CC1AA  [DB2CC1AA]  266.5,326 0 top
S7  SPDTDB2CC1AA  [DB2CC1AA]  316.5,326 180 top
S8  SPDTDB2CC1AA  [DB2CC1AA]  16.5,276 0 top
S9  SPDTDB2CC1AA  [DB2CC1AA]  66.5,276 0 top
S10  SPDTDB2CC1AA  [DB2CC1AA]  116.5,276 0 top
S11  SPDTDB2CC1AA  [DB2CC1AA]  166.5,276 0 top
S12  SPDTDB2CC1AA  [DB2CC1AA]  216.5,276 0 top
S13  SPDTDB2CC1AA  [DB2CC1AA]  266.5,276 180 top
S14  SPDTDB2CC1AA  [DB2CC1AA]  316.5,276 0 top
S15  SPDTDB2CC1AA  [DB2CC1AA]  16.5,226 0 top
S16  SPDTDB2CC1AA  [DB2CC1AA]  66.5,226 0 top
S17  SPDTDB2CC1AA  [DB2CC1AA]  116.5,226 0 top
S18  SPDTDB2CC1AA  [DB2CC1AA]  166.5,226 0 top
S19  SPDTDB2CC1AA  [DB2CC1AA]  216.5,226 0 top
S20  SPDTDB2CC1AA  [DB2CC1AA]  266.5,226 180 top
S21  SPDTDB2CC1AA  [DB2CC1AA]  316.5,226 0 top
S22  SPDTDB2CC1AA  [DB2CC1AA]  16.5,176 0 top
S23  SPDTDB2CC1AA  [DB2CC1AA]  66.5,176 0 top
S24  SPDTDB2CC1AA  [DB2CC1AA]  116.5,176 180 top
S25  SPDTDB2CC1AA  [DB2CC1AA]  166.5,176 0 top
S26  SPDTDB2CC1AA  [DB2CC1AA]  216.5,176 0 top
S27  SPDTDB2CC1AA  [DB2CC1AA]  266.5,176 180 top
S28  SPDTDB2CC1AA  [DB2CC1AA]  316.5,176 0 top
S29  SPDTDB2CC1AA  [DB2CC1AA]  16.5,126 0 top
S30  SPDTDB2CC1AA  [DB2CC1AA]  66.5,126 0 top
S31  SPDTDB2CC1AA  [DB2CC1AA]  116.5,126 180 top
S32  SPDTDB2CC1AA  [DB2CC1AA]  216.5,126 0 top
S33  SPDTDB2CC1AA  [DB2CC1AA]  266.5,126 0 top
S34  SPDTDB2CC1AA  [DB2CC1AA]  316.5,126 0 top
S35  SPDTDB2CC1AA  [DB2CC1AA]  166.5,107 0 top
S36  SPDTDB2CC1AA  [DB2CC1AA]  16.5,76 0 top
S37  SPDTDB2CC1AA  [DB2CC1AA]  66.5,76 0 top
S38  SPDTDB2CC1AA  [DB2CC1AA]  116.5,76 0 top
S39  SPDTDB2CC1AA  [DB2CC1AA]  166.5,76 0 top
S40  SPDTDB2CC1AA  [DB2CC1AA]  216.5,76 0 top
S41  SPDTDB2CC1AA  [DB2CC1AA]  266.5,76 0 top
S42  SPDTDB2CC1AA  [DB2CC1AA]  316.5,76 0 top
S43  SPDTDB2CC1AA  [DB2CC1AA]  16.5,26 0 top
S44  SPDTDB2CC1AA  [DB2CC1AA]  66.5,26 0 top
S45  SPDTDB2CC1AA  [DB2CC1AA]  116.5,26 0 top
S46  SPDTDB2CC1AA  [DB2CC1AA]  166.5,26 0 top
S47  SPDTDB2CC1AA  [DB2CC1AA]  216.5,26 0 top
S48  SPDTDB2CC1AA  [DB2CC1AA]  266.5,26 0 top
S49  SPDTDB2CC1AA  [DB2CC1AA]  316.5,26 0 top
SCREW1  SCREW-632-0-PSHP  [SMTPR-6-1]  291.5,41.5 0 bottom
SCREW2  SCREW-632-0-PSHP  [SMTPR-6-1]  41.5,41.5 0 bottom
SCREW3  SCREW-632-0-PSHP  [SMTPR-6-1]  191.5,91.5 0 bottom
SCREW4  SCREW-632-0-PSHP  [SMTPR-6-1]  91.5,141.5 0 bottom
SCREW5  SCREW-632-0-PSHP  [SMTPR-6-1]  241.5,191.5 0 bottom
SCREW6  SCREW-632-0-PSHP  [SMTPR-6-1]  141.5,241.5 0 bottom
SCREW7  SCREW-632-0-PSHP  [SMTPR-6-1]  291.5,291.5 0 bottom
SCREW8  SCREW-632-0-PSHP  [SMTPR-6-1]  41.5,291.5 0 bottom
TP1  TP-CIR30  [SMD_CIR30]  34.42,116.97 0 bottom
TP2  TP-CIR30  [SMD_CIR30]  34.42,119.51 180 bottom
TP3  TP-CIR30  [SMD_CIR30]  34.42,122.05 180 bottom
TP4  TP-CIR30  [SMD_CIR30]  34.42,124.59 180 bottom
TP5  TP-CIR30  [SMD_CIR30]  34.42,127.13 180 bottom
TVS1  24V  [SMC/DO214AB]  234.57,65.41 270 top

## Tracks (layer width: path | path; a pad name or v marks a point on that pad's centre or on a via)
+3V3  (via drill 0.3, 0.3 pad 0.25, 0.38)
  Top 0.203: IC1.5 128.42,295.27 C3.2 128.24,294.21 v128.26,294.19 | C4.2 124.8,294.44 v125.06,294.19 | IC3.3 114.75,286.4 114.61,286.26 113.95,286.26 113.8,286.41 113.75,286.46 IC3.1 | v115.19,280.04 115.28,280.13 R17.2
  Top 0.254: IC3.48 111.39,288.75 110.23,287.58 C8.2 107.66,286.74 C10.2 110.73,285.8 112.18,287.25 IC3.1 | FB1.2 R17.2 | IC3.24 120.75,295.06 121.15,295.46 123.69,295.46 123.92,295.23 C4.2
  Top 0.305: R17.2 115.28,282.02 v114.8,282.5 | v108.8,286.72 107.69,286.72 107.66,286.74
  Route3 0.203: v40.01,133.48 40.01,135 38.74,136.27 4.45,136.27 2.16,138.56 2.16,263.02 11.81,272.67 112.14,272.67 114.43,274.96 114.43,279.28 v115.19,280.04
  Bottom 0.203: J7.1 v40.01,133.48
  pour Route2 (isolate 0.305): 103.88,294.95 128.77,294.95 128.77,286.82 121.91,279.96 103.88,279.96
+3V3.B  (via drill 0.3, 0.3 pad 0.25, 0.38)
  Top 0.203: IC11.5 121.06,195.27 C46.2 120.87,194.21 v120.89,194.19 | C47.2 117.44,194.44 v117.69,194.19 | IC13.2 106.88,188.17 106.58,188.47 106.3,188.75 IC13.48 | v107.9,180.04 107.91,180.05 R68.2
  Top 0.254: IC13.48 104.03,188.75 102.86,187.58 C50.2 100.3,186.74 C52.2 103.37,185.8 104.81,187.25 IC13.1 | FB3.2 R68.2 | IC13.24 113.38,195.06 113.78,195.46 116.32,195.46 116.55,195.23 C47.2
  Top 0.305: R68.2 107.91,182.02 v107.43,182.5 | v101.44,186.72 100.32,186.72 100.3,186.74
  Route3 0.203: v50.68,133.48 50.68,137.8 44.07,144.4 20.96,144.4 6.73,158.63 6.73,167.26 11.81,172.34 100.21,172.34 v107.9,180.04
  Bottom 0.203: J6.1 v50.68,133.48
  pour Route2 (isolate 0.305): 98.8,195.2 121.4,194.95 121.4,186.82 121.91,179.96 98.8,180.22
+3V3.C  (via drill 0.3, 0.38, 0.51)
  Top 0.203: IC23.5 228.42,45.27 C85.2 228.24,44.21 v228.26,44.19 | C86.2 224.8,44.44 v225.06,44.19
  Top 0.254: IC25.48 211.39,38.75 210.23,37.58 C90.2 207.66,36.74 C92.2 210.73,35.8 212.18,37.25 IC25.1 | FB5.2 R108.2 | IC25.24 220.75,45.06 221.15,45.46 223.69,45.46 223.92,45.23 C86.2 | IC22.1 142.24,73.16 141.86,72.77 138.05,72.77 137.54,73.28 137.52,73.31 C79.2 v136.53,71.76
  Top 0.305: R108.2 215.28,32.02 v214.8,32.5 | v208.8,36.72 207.69,36.72 207.66,36.74
  Route3 0.203: 152.53,69.47 138.81,69.47 v136.53,71.76 | v40.01,115.19 36.96,115.19 35.94,116.21 29.59,116.21 23.24,109.86 6.23,109.86 1.4,105.03 1.4,13.34 13.34,1.4 68.96,1.4 90.55,22.99 199.77,22.99 208.92,32.13 214.43,32.13 v214.8,32.5
  Route3 0.254: 152.53,69.47 165.99,56.01 192.15,56.01 v203.08,45.09
  Bottom 0.203: J4.1 v40.01,115.19
  pour Route2 (isolate 0.305): 202.61,45.46 228.77,45.46 228.77,36.82 221.91,29.96 202.61,29.96
+3V3.D  (via drill 0.3, 0.38)
  Top 0.203: IC8.5 287.73,228.42 C37.2 288.79,228.24 v288.81,228.26 | C38.2 288.56,224.8 v288.81,225.06 | IC9.3 294.51,214.75 294.26,214.51 294.25,214.49 294.25,214.25 | 294.25,214.25 294.25,211.97 | IC9.2 294.25,214.25
  Top 0.254: IC9.48 294.25,211.97 294.25,211.39 295.42,210.23 C43.2 296.26,207.66 C44.2 297.2,210.73 295.75,212.18 IC9.1 | FB2.2 R43.2 | IC9.24 287.94,220.75 287.54,221.15 287.54,223.69 287.77,223.92 C38.2 | R54.2 289.36,201.88 v289.44,201.81
  Top 0.305: R43.2 300.98,215.28 v300.5,214.8 | v296.28,208.8 296.28,207.69 296.26,207.66
  Route3 0.203: v53.22,124.08 53.22,127.89 58.55,133.23 98.68,133.23 104.27,138.81 135.77,138.81 148.97,125.61 187.58,125.61 233.56,171.58 233.56,196.73 240.67,203.84 v252.1,203.84 | v255.91,203.84 275.21,203.84 281.56,210.19 292.23,210.19 293.5,208.92 293.62,208.8 v296.28,208.8
  Bottom 0.203: J5.1 v53.22,124.08 | v252.1,203.84 v255.91,203.84
  pour Route2 (isolate 0.305): 288.05,201.34 288.05,228.77 296.18,228.77 303.04,221.91 303.04,201.34
+3V3.E  (via drill 0.3, 0.38)
  Top 0.203: IC16.5 80.67,95.27 C61.2 80.48,94.21 v80.51,94.19 | C62.2 77.05,94.44 v77.31,94.19 | v54.74,84.46 54.18,85.02 C68.2 54.18,87.45 54.23,87.51 54.81,88.08 IC20.2
  Top 0.254: IC18.48 63.64,88.75 62.47,87.58 C66.2 59.91,86.74 C69.2 62.98,85.8 64.43,87.25 IC18.1 | FB4.2 R85.2 | IC18.24 73,95.06 73.4,95.46 75.94,95.46 76.17,95.23 C62.2
  Top 0.305: R85.2 67.53,82.02 v67.05,82.5 | v61.05,86.72 59.93,86.72 59.91,86.74
  Route3 0.203: v50.42,115.19 52.2,115.19 52.96,114.43 52.96,103.25 59.31,96.9 59.31,96.8 v59.77,96.34
  Bottom 0.203: J3.1 v50.42,115.19
  pour Route2 (isolate 0.305): 54.35,96.73 81.02,96.98 81.02,86.82 74.16,79.96 54.35,79.71
+5V  (via drill 0.3, 0.3 pad 0.25, 0.51)
  Top 0.203: v71.36,283.52 71.86,284.01 71.86,285.88 | C2.2 161.76,297.07 161.72,297.11 161.04,297.11 161.01,297.13 161.01,298.78 160.99,298.81 | C14.2 285.89,265.06 285.88,265.05 285.88,264.29 285.86,264.31 284.25,264.31 | C26.2 251.89,244.58 252.2,244.88 v252.2,245.19 252.2,247.02 251.89,247.32 R25.2 | v234.06,257.43 C15.+ | R7.2 v151.51,298.33 151.51,297.31 150.78,296.57 R12.2 | R32.2 v284.61,244.73 285.5,244.73 286.08,244.15 R30.2
  Top 0.254: IC2.28 70.72,287.74 71.14,287.33 C9.2 | IC4.28 162.28,295.22 161.76,295.74 C2.2 | IC4.26 163.57,294.31 163.57,295.71 | IC2.26 69.42,287.24 69.59,287.07 | 287.78,265.57 287.26,265.06 287.78,265.57 | IC5.26 288.69,266.87 287.19,266.87 287.15,266.83 | IC5.28 287.78,265.57 | v0.89,133.99 0.64,134.24 0.64,242.19 1.65,243.21
  Route3 0.203: v252.2,245.19 252.2,242.45 247.37,237.62 247.32,237.62 234.83,237.62 232.54,239.91 232.54,255.91 v234.06,257.43
  Route3 0.254: v32.9,127.13 30.1,129.92 4.96,129.92 v0.89,133.99
  Bottom 0.254: TP5.P$1 v32.9,127.13
  other vias: 158.99,298.5 68.01,319 68.5,320 64.99,319 64.5,320 63.5,319 62.8,318 63.5,317 69.5,319 70.2,318 69.5,317 18.01,319 18.5,320 19.5,319 20.2,318 19.5,317 14.99,319 14.5,320 13.5,319 12.8,318 13.5,317 14.99,269 14.5,270 13.5,269 12.8,268 13.5,267 18.01,269 18.5,270 19.5,269 20.2,268 19.5,267 114.99,319 113.5,319 113.5,317 112.8,318 114.5,320 118.5,320 118.01,319 119.5,319 120.2,318 119.5,317 114.99,269 113.5,269 113.5,267 112.8,268 114.5,270 118.5,270 118.01,269 119.5,269 119.5,267 120.2,268 168.01,269 164.99,269 164.5,270 163.5,269 162.8,268 163.5,267 169.5,267 170.2,268 169.5,269 168.5,270 214.99,269 213.5,269 213.5,267 212.8,268 214.5,270 218.5,270 218.01,269 219.5,269 220.2,268 219.5,267 214.99,319 218.01,319 214.5,320 213.5,319 212.8,318 213.5,317 219.5,317 220.2,318 219.5,319 218.5,320 168.01,319 168.5,320 169.5,319 170.2,318 169.5,317 164.99,319 164.5,320 163.5,319 162.8,318 163.5,317 68.01,269 68.5,270 69.5,269 70.2,268 69.5,267 64.99,269 64.5,270 63.5,269 62.8,268 63.5,267 97.02,300.03 108.45,295.96 70.09,301.04 72.63,303.58 75.17,301.04 77.71,303.58 80.25,301.04 82.79,303.58 85.33,301.04 87.87,303.58 90.41,301.04 92.95,303.58 105.65,303.58 110.73,303.58 165.01,283.95 159.93,283.95 154.85,283.95 149.77,283.95 144.69,283.95 139.61,283.95 284.5,262.29 318.01,269 314.99,269 314.5,270 313.5,269 312.8,268 313.5,267 319.5,267 320.2,268 319.5,269 318.5,270 314.99,319 313.5,319 313.5,317 312.8,318 314.5,320 318.5,320 318.01,319 319.5,319 320.2,318 319.5,317 264.99,319 268.01,319 264.5,320 263.5,319 262.8,318 263.5,317 269.5,317 270.2,318 269.5,319 268.5,320 268.01,269 268.5,270 269.5,269 270.2,268 269.5,267 264.99,269 264.5,270 263.5,269 262.8,268 263.5,267 300.07,266.79 300.07,262.22 300.07,257.14 300.07,252.06 300.07,246.98 300.07,241.9 288.1,238.19 318.01,219 314.99,219 314.5,220 313.5,219 312.8,218 313.5,217 319.5,217 320.2,218 319.5,219 318.5,220 269.49,217.01 270.2,218 262.81,218.03 263.5,217.01 263.52,219.01 264.49,220 265,219.01 268.02,219.01 268.53,220 269.49,219.01 279.4,210.88 279.4,205.8 287.02,208.34 282.95,196.91 284.99,225.11 125.21,298
  pour Route2 (isolate 0.305, rank 6): 1.15,242.45 225.43,242.45 242.45,225.43 242.45,192.41 331.85,192.41 331.85,319.92 319.92,331.85 13.08,331.85 1.15,319.92
  pour Top (isolate 0.254, rank 6): 0.64,241.94 81.66,241.94 81.66,255.91 104.78,255.91 104.78,253.62 214.51,253.62 241.94,226.19 241.94,191.9 332.36,191.9 332.36,320.17 320.17,332.36 12.83,332.36 0.64,320.17
+5VB  (via drill 0.3, 0.3 pad 0.25, 0.51)
  Top 0.203: C80.2 303.2,73.89 303.51,74.2 v303.51,74.5 303.51,76.33 303.2,76.64 R90.2 | v285.37,86.74 C70.+ | R98.2 v251.08,48.39 251.08,47.37 250.6,46.89 R103.2
  Top 0.254: IC24.28 170.72,37.74 171.13,37.33 C91.2 | IC26.28 262.27,45.22 261.76,45.73 C84.2 | IC26.26 263.57,44.31 263.57,45.71 | IC24.26 169.43,37.24 169.59,37.07 | IC14.28 295.26,167.68 295.67,168.09 | IC14.26 295.76,166.38 295.93,166.54 | v0.89,124.34 0.64,124.08 0.64,52.96 0.89,52.71
  Route3 0.203: v303.51,74.5 303.51,71.76 298.68,66.93 298.63,66.93 286.13,66.93 283.85,69.22 283.85,85.22 v285.37,86.74
  Route3 0.254: v32.9,124.59 31.63,124.59 27.82,128.4 4.96,128.4 v0.89,124.34
  Bottom 0.254: TP4.P$1 v32.9,124.59
  other vias: 279.14,189.79 281.68,187.25 279.14,184.71 281.68,182.17 279.14,179.63 281.68,177.09 279.14,174.55 281.68,172.01 279.39,169.73 299.46,168.2 214.99,19 218.01,19 214.5,20 213.5,19 212.8,18 213.5,17 219.5,17 220.2,18 219.5,19 218.5,20 314.99,69 318.01,69 314.5,70 313.5,69 312.8,68 313.5,67 319.5,67 320.2,68 319.5,69 318.5,70 264.99,19 268.01,19 264.5,20 263.5,19 262.8,18 263.5,17 269.5,17 270.2,18 269.5,19 268.5,20 314.99,19 318.01,19 314.5,20 313.5,19 312.8,18 313.5,17 319.5,17 320.2,18 319.5,19 318.5,20 164.99,19 168.01,19 164.5,20 163.5,19 162.8,18 163.5,17 169.5,17 170.2,18 169.5,19 168.5,20 114.99,69 118.01,69 114.5,70 113.5,69 112.8,68 113.5,67 119.5,67 120.2,68 119.5,69 118.5,70 64.99,19 68.01,19 64.5,20 63.5,19 62.8,18 63.5,17 69.5,17 70.2,18 69.5,19 68.5,20 114.99,19 118.01,19 114.5,20 113.5,19 112.8,18 113.5,17 119.5,17 120.2,18 119.5,19 118.5,20 14.99,19 18.01,19 14.5,20 13.5,19 12.8,18 13.5,17 19.5,17 20.2,18 19.5,19 18.5,20 164.99,69 168.01,69 164.5,70 163.5,69 162.8,68 163.5,67 169.5,67 170.2,68 169.5,69 168.5,70 214.99,69 218.01,69 214.5,70 213.5,69 212.8,68 213.5,67 219.5,67 220.2,68 219.5,69 218.5,70 264.99,69 268.01,69 264.5,70 263.5,69 262.8,68 263.5,67 269.5,67 270.2,68 269.5,69 268.5,70 264.99,169 268.01,169 264.5,170 263.5,169 262.8,168 263.5,167 269.5,167 270.2,168 269.5,169 268.5,170 314.99,169 318.01,169 314.5,170 313.5,169 312.8,168 313.5,167 319.5,167 320.2,168 319.5,169 318.5,170 314.99,119 318.01,119 314.5,120 313.5,119 312.8,118 313.5,117 319.5,117 320.2,118 319.5,119 318.5,120 264.99,119 268.01,119 264.5,120 263.5,119 262.8,118 263.5,117 269.5,117 270.2,118 269.5,119 268.5,120 170.17,51.11 172.71,53.65 175.25,51.11 177.79,53.65 180.33,51.11 182.87,53.65 185.41,51.11 187.95,53.65 190.49,51.11 193.03,53.65 205.73,53.65 210.81,53.65 196.84,50.09 204.46,47.55 258.82,48.57 259.93,33.96 254.85,33.96 249.77,33.96 244.69,33.96 239.61,33.96 265.01,33.96 171.36,33.53 281.93,167.19 302,186.74 302,181.66 302,176.58 302,171.5 225.29,47.81
  pour Top (rank 6): 241.94,190.88 332.36,190.88 332.36,12.83 320.17,0.64 12.83,0.64 0.64,12.83 0.64,52.96 92.59,52.96 130.69,91.06 219.59,91.06 241.94,113.41
  pour Route2 (isolate 0.305, rank 6): 242.45,190.38 331.85,190.38 331.85,13.08 319.92,1.15 13.08,1.15 1.15,13.08 1.15,52.45 92.84,52.45 130.94,90.55 219.84,90.55 242.45,113.16
+5VC  (via drill 0.3, 0.51)
  Top 0.203: C23.2 84.41,247.42 84.1,247.12 v84.1,246.81 84.1,244.99 84.41,244.68 R28.2 | v102.24,234.57 C34.+ | R47.2 174.6,209.83 v174,210.44 | v71.36,183.52 71.86,184.01 71.86,185.98 | C51.2 71.15,186.81 71.15,185.96 | v177.81,217.81 178.19,218.19 179.81,218.19 179.84,218.16 179.84,216.41 180.55,216.41 180.56,216.4 C42.2 | v36.31,83.52 36.83,84.04 36.83,85.96 36.1,85.96 36.08,85.97 C67.2 | v101.26,98.43 101.79,98.96 103.33,98.96 103.38,98.91 103.38,97.13 104.09,97.13 104.1,97.12 C60.2 | R74.2 v93.16,98.43 | v93.16,98.43
  Top 0.254: IC10.28 181.07,214.53 180.56,215.04 C42.2 | IC10.26 182.36,213.61 182.36,215.01 | IC12.28 70.72,187.74 71.14,187.33 C51.2 | IC12.26 69.42,187.24 69.59,187.07 | IC19.28 104.62,95.22 104.1,95.73 C60.2 | IC19.26 105.91,94.31 105.91,95.71 | IC17.28 35.67,87.74 36.08,87.33 C67.2 | IC17.26 34.37,87.23 34.53,87.07
  Route3 0.203: v84.1,246.81 84.1,249.56 88.93,254.38 88.98,254.38 101.48,254.38 103.76,252.1 103.76,236.1 v102.24,234.57
  Bottom 0.254: TP3.P$1 v32.9,122.05
  other vias: 14.99,219 14.5,220 13.5,219 12.8,218 13.5,217 18.01,219 18.5,220 19.5,219 20.2,218 19.5,217 64.99,219 64.5,220 63.5,219 62.8,218 63.5,217 68.01,219 68.5,220 69.5,219 70.2,218 69.5,217 114.99,219 114.5,220 113.5,219 112.8,218 113.5,217 118.01,219 118.5,220 119.5,219 120.2,218 119.5,217 164.99,219 164.5,220 163.5,219 162.8,218 163.5,217 168.01,219 168.5,220 169.5,219 170.2,218 169.5,217 214.99,219 214.5,220 213.5,219 212.8,218 213.5,217 218.01,219 218.5,220 219.5,219 220.2,218 219.5,217 214.99,169 214.5,170 213.5,169 212.8,168 213.5,167 218.01,169 218.5,170 219.5,169 220.2,168 219.5,167 164.99,169 164.5,170 163.5,169 162.8,168 163.5,167 168.01,169 168.5,170 169.5,169 170.2,168 169.5,167 114.99,169 114.5,170 113.5,169 112.8,168 113.5,167 118.01,169 118.5,170 119.5,169 120.2,168 119.5,167 64.99,169 64.5,170 63.5,169 62.8,168 63.5,167 68.01,169 68.5,170 69.5,169 70.2,168 69.5,167 14.99,169 14.5,170 13.5,169 12.8,168 13.5,167 18.01,169 18.5,170 19.5,169 20.2,168 19.5,167 14.99,119 14.5,120 13.5,119 12.8,118 13.5,117 18.01,119 18.5,120 19.5,119 20.2,118 19.5,117 64.99,119 64.5,120 63.5,119 62.8,118 63.5,117 68.01,119 68.5,120 69.5,119 70.2,118 69.5,117 114.99,119 114.5,120 113.5,119 112.8,118 113.5,117 118.01,119 118.5,120 119.5,119 120.2,118 119.5,117 164.99,119 164.5,120 163.5,119 162.8,118 163.5,117 168.01,119 168.5,120 169.5,119 170.2,118 169.5,117 214.99,119 214.5,120 213.5,119 212.8,118 213.5,117 218.01,119 218.5,120 219.5,119 220.2,118 219.5,117 64.99,69 64.5,70 63.5,69 62.8,68 63.5,67 68.01,69 68.5,70 69.5,69 70.2,68 69.5,67 14.99,69 14.5,70 13.5,69 12.8,68 13.5,67 18.01,69 18.5,70 19.5,69 20.2,68 19.5,67 107.36,83.95 102.78,83.95 97.7,83.95 92.62,83.95 49.27,100.03 45.2,101.04 47.74,103.58 42.66,103.58 40.12,101.04 37.58,103.58 35.04,101.04 53.08,95.74 92.62,89.28 92.62,86.49 90.92,200.03 101.08,195.96 70.09,201.04 72.63,203.58 75.17,201.04 77.71,203.58 80.25,201.04 82.79,203.58 85.33,201.04 87.87,203.58 105.65,203.58 110.73,203.58 117.34,199.27
  pour Top (isolate 0.254, rank 6): 0.64,240.92 82.68,240.92 82.68,254.89 103.76,254.89 103.76,252.61 214,252.61 240.92,225.68 240.92,113.92 219.08,92.08 130.18,92.08 92.08,53.98 0.64,53.98
  pour Route2 (rank 6): 1.15,240.41 224.41,240.41 240.41,224.41 240.41,114.18 218.82,92.59 129.92,92.59 91.82,54.49 1.15,54.49
+24V  (via drill 0.3, 0.3 pad 0.25, 0.51, 0.76)
  Top 0.203: R36.1 R33.2 v83.95,241.94 | R86.1 R87.2 v303.66,79.38 | R20.1 R22.2 v252.35,250.07 | 225.68,244.99 232.29,238.38 237.62,238.38 239.31,240.07 C30.+
  Top 0.254: v1.91,134.5 1.15,135.26 1.15,236.86 1.91,237.62 7.5,237.62 11.31,241.43 81.66,241.43 82.17,241.94 82.17,254.64 82.93,255.4 93.35,255.4 93.49,255.4 C19.+
  Top 0.406: L4.1 v146.18,80.14
  Top 0.61: IC15.1 238,142.04 C58.2 241.38,145.98 241.43,145.93
  Top 1.016: v228.98,80.14 234.61,74.51 234.61,72.99 234.57,72.95
  Top 1.27: v225.56,245.11 225.68,244.99 226.95,243.72
  Top 2.54: FUSE1.2 277.83,79.81 281.56,76.08 281.56,69.22 282.32,68.46 286.13,68.46
  Top 3.81: TVS1.C 234.57,72.95 FUSE1.2 241.43,84.38 241.43,85.23 241.43,91.56 241.43,101.22 241.43,145.93 241.43,180.43 233.81,188.05 233.81,193.68 233.81,194.97 241.18,202.34 241.18,229.49 226.95,243.72 225.68,244.99 v225.56,245.11 217.81,252.86 187.07,252.86 | 187.07,252.86 102.75,252.86 | PWR1.1 187.07,252.86
  Route3 0.254: v32.9,119.51 33.91,120.53 33.91,128.15 31.37,130.69 5.72,130.69 v1.91,134.5
  Route3 1.016: v146.18,80.14 v228.98,80.14
  Route3 1.27: v287.4,326.52 284.36,329.57 256.92,329.57 229.49,302.14 229.49,249.05 v225.56,245.11
  Bottom 0.203: v83.95,241.94 90.2,248.19 v92.79,248.19 | v303.66,79.38 297.41,73.13 v294.82,73.13 | v252.35,250.07 246.1,243.82 v243.51,243.82
  Bottom 0.254: LED50.A 289.68,326.52 v287.4,326.52 | TP2.P$1 v32.9,119.51
  pour Top: 92.33,243.46 92.33,254.79 103.76,254.79 103.76,251.08 99.44,251.08 96.9,248.8 100.97,244.73 100.97,243.46
  pour Top: 243.97,248.54 243.97,237.21 232.54,237.21 232.54,240.92 236.86,240.92 239.4,243.21 235.33,247.27 235.33,248.54
  pour Top: 295.28,77.85 295.28,66.53 283.85,66.53 283.85,70.23 288.17,70.23 290.71,72.52 286.64,76.58 286.64,77.85
+24V_OUT
  Top 0.203: L4.2 146.18,61.85 145.67,61.34 J2.6
BLANK  (via drill 0.3)
  Top 0.203: v114.29,297.49 114.3,297.5 R9.1
  Top 0.254: IC2.2 70.08,297.47 70.35,297.74 101.08,297.74 102.61,299.27 v115.05,299.27 | IC3.33 115.25,296.53 v114.29,297.49
  Bottom 0.254: v115.05,299.27 115.05,298.25 v114.29,297.49
BLANK1  (via drill 0.3)
  Top 0.203: v106.92,197.49 106.94,197.5 R60.1
  Top 0.254: IC12.2 70.08,197.47 70.35,197.74 94.99,197.74 96.51,199.27 v107.69,199.27 | IC13.33 107.88,196.53 v106.92,197.49
  Bottom 0.254: v106.92,197.49 107.32,197.49 107.57,197.74 107.69,197.86 v107.69,199.27
BLANK1.1  (via drill 0.3 pad 0.61)
  Top 0.203: IC10.2 181.72,207.02 181.33,206.63 175.87,206.63 174.17,208.33 173.31,208.33 173.13,208.51 R47.1 172.22,209.17 171.43,208.38 171.38,208.33 149.56,208.33 | IC13.6 108.88,188.56 108.84,188.6 v108.84,189.61
  Top 0.254: 149.56,208.33 148.21,209.68 122.41,209.68 112.75,200.03 v111.64,200.03
  Route3 0.254: v111.64,200.03 111.64,199.44 110.87,198.68 110.87,194.69 108.84,192.66 v108.84,189.61
BLANK2  (via drill 0.3)
  Top 0.203: R100.1 213.79,47.5 214.28,47.5 v214.54,47.23
  Top 0.254: IC24.2 170.07,47.47 170.35,47.74 201.08,47.74 202.61,49.27 v215.05,49.27 | IC25.33 215.25,46.53 v214.54,47.23
  Bottom 0.254: v215.05,49.27 215.05,47.74 v214.54,47.23
BLANK2.1  (via drill 0.3)
  Top 0.203: IC25.6 216.25,39.28 216.06,39.47 v216.06,40.62 | 249.86,46.71 249.86,45.19
  Top 0.254: IC26.2 262.93,37.7 262.54,37.32 257.74,37.32 249.86,45.19 | v219.05,50.04 220.37,50.04 220.88,50.55 244.5,50.55 244.55,50.5 246.66,48.39 R98.1 248.31,47.55 248.69,47.17 249.41,47.17 249.86,46.71
  Route3 0.203: v219.05,50.04 218.39,49.38 218.39,44.25 218.39,43.46 216.06,41.13 v216.06,40.62
BLANK3  (via drill 0.3)
  Top 0.203: R46.1 285.5,213.79 285.5,214.28 v285.51,214.29
  Top 0.254: IC14.2 285.53,167.03 285.26,167.3 285.26,201.08 283.73,202.61 v283.73,215.05 | IC9.33 286.47,215.25 v285.51,214.29
  Bottom 0.254: v283.73,215.05 284.75,215.05 v285.51,214.29
BLANK3.1  (via drill 0.3 pad 0.61)
  Top 0.203: v292.41,216.03 293.5,216.03 293.72,216.25 IC9.6 | 286.31,243.41 287.96,243.41
  Top 0.254: IC5.2 296.31,266.23 296.68,265.87 296.68,252.12 287.96,243.41 | v282.98,219.08 282.98,220.15 282.48,220.65 282.48,237.93 284.61,240.06 R32.1 285.47,241.96 285.86,242.34 285.86,242.95 286.31,243.41
  Route3 0.254: v282.98,219.08 283.7,218.37 289.61,218.37 291.95,216.03 v292.41,216.03
BLANK4  (via drill 0.3)
  Top 0.203: R76.1 66.3,97.5 66.53,97.5 v67.05,96.98
  Top 0.254: IC17.2 35.02,97.47 35.3,97.74 53.33,97.74 54.85,99.27 v67.3,99.27 | IC18.33 67.5,96.53 v67.05,96.98
  Bottom 0.203: v67.05,96.98 67.3,97.23 v67.3,99.27
BLANK4.1  (via drill 0.3)
  Top 0.203: IC19.2 105.27,87.67 104.93,87.33 100.44,87.33 v99.9,87.86 | IC18.6 68.5,86.35 64.9,82.76 64.9,80.39 65.41,79.89 82.68,79.89 90.66,87.86 v94.08,87.86 94.14,87.81 R82.1
  Bottom 0.203: v99.9,87.86 v94.08,87.86
BLANK.1  (via drill 0.3 pad 0.61)
  Top 0.203: v115.9,290.55 115.9,289.74 115.95,289.69 116.25,289.39 IC3.6 | 150.04,296.75 150.04,295.02
  Top 0.254: IC4.2 162.93,287.72 162.54,287.33 157.74,287.33 150.04,295.02 | v119.08,300.03 120.15,300.03 120.65,300.54 144.53,300.54 146.74,298.33 R7.1 148.75,297.54 149.23,297.06 149.74,297.06 149.99,296.8 150.04,296.75
  Route3 0.254: v119.08,300.03 119.08,299.47 117.94,298.33 117.94,293.09 115.9,291.06 v115.9,290.55
CHAIN1  (via drill 0.3)
  Top 0.254: IC13.31 108.88,197.27 v108.54,197.62 | v78.11,108.33 R70.2
  Route3 0.203: v99.95,170.56 123.57,146.94 v123.57,141.86
  Route3 0.254: v108.54,197.62 99.95,189.03 99.95,184.03 v99.95,175.64 | v78.11,108.33 122.05,108.33 127.13,113.41 127.13,124.84 123.57,128.4 v123.57,134.75
  Bottom 0.254: v99.95,175.64 v99.95,170.56 | v123.57,141.86 v123.57,134.75
CHAIN2  (via drill 0.3)
  Top 0.254: IC3.31 116.25,297.27 115.7,297.82 v115.7,298.33 | R48.2 v106.81,208.16
  Route3 0.254: v115.7,298.33 115.7,297.31 110.37,291.98 108.33,291.98 99.7,283.34 v99.7,275.72 | v114.18,230 108.84,235.33 108.84,261.24 v99.7,270.39 | v114.18,226.95 114.18,224.92 106.81,217.55 106.81,209.17 v106.81,208.16
  Bottom 0.254: v99.7,275.72 v99.7,270.39 | v114.18,230 v114.18,226.95
CHAIN3  (via drill 0.3)
  Top 0.254: IC9.31 285.59,216.25 285.12,215.78 v284.86,215.78 | R3.2 v122.81,306.71
  Route3 0.254: v284.86,215.78 283.34,215.78 282.83,215.27 280.8,215.27 278.01,218.06 278.01,220.86 v274.2,224.67 | v148.47,306.71 196.98,306.71 200.54,306.71 224.16,283.09 224.16,254.89 224.16,243.97 228.22,239.91 236.35,231.78 v271.91,231.78
  Bottom 0.254: v274.2,224.67 274.2,229.49 v271.91,231.78 | v148.47,306.71 v122.81,306.71
CHAIN4  (via drill 0.3)
  Top 0.254: IC25.31 216.25,47.41 v215.78,47.88 | R44.2 v256.16,211.2
  Route3 0.203: v215.78,47.88 215.78,49.56 215.22,50.12 215.22,54.94 v216.79,56.52
  Route3 0.254: v253.37,211.2 253.37,187.33 219.71,153.67 219.71,139.7 230.51,128.91 230.51,73.28 225.68,68.46 v225.68,56.52
  Bottom 0.254: v216.79,56.52 v225.68,56.52 | v253.37,211.2 v256.16,211.2
FAN_PWM  (via drill 0.51)
  Top 0.254: R52.2 293.25,200.79 291.72,199.27 v288.42,199.27
  Route3 0.254: v288.42,199.27 283.09,199.27 276.23,192.41 276.23,133.73 274.7,132.21 274.7,111.64 271.91,108.84 254.13,108.84 222.63,140.34 222.63,146.94 223.65,147.96 227.37,147.96 J8.4
FAN_TACH  (via drill 0.51)
  Top 0.254: v286.9,203.33 286.92,203.35 R54.1 R51.2
  Route3 0.254: v286.9,203.33 286.13,203.33 285.88,203.08 275.47,192.66 275.47,191.65 275.47,134.24 273.94,132.72 273.94,111.89 271.66,109.6 254.64,109.6 224.92,139.32 224.92,144.62 J8.3
GND  (via drill 0.3, 0.38, 0.51)
  Top 0.203: v125.54,295.46 C3.1 | C1.1 126.76,296.32 | 126.76,296.32 C3.1 | IC1.2 132.41,296.32 126.76,296.32 | C5.1 127.5,293.42 126.76,294.16 C3.1 | v123.87,293.17 123.59,293.17 123.18,293.58 123.18,294.19 122.93,294.44 C4.1 122.44,293.78 122.32,293.65 121.73,293.65 121.63,293.75 IC3.23 | R14.2 R15.2 v130.42,289.06 130.42,287.68 | RN2.D2 130.06,281.76 130.42,282.12 130.42,282.55 | 130.42,282.55 130.42,283.34 | 130.42,283.34 130.42,284.13 | 130.42,284.13 130.42,285.3 | 130.42,285.3 130.42,286.13 | 130.42,286.13 130.42,286.9 | 130.42,286.9 130.42,287.68 | RN2.C2 130.41,282.56 130.42,282.55 | RN2.B2 130.4,283.36 130.42,283.34 | RN2.A2 130.39,284.16 130.42,284.13 | RN1.D2 130.4,285.31 130.42,285.3 | RN1.C2 130.4,286.12 130.42,286.13 | RN1.B2 130.4,286.92 130.42,286.9 | RN1.A2 130.39,287.72 130.42,287.68 | v118.18,195.46 C46.1 | C45.1 119.4,196.32 | 119.4,196.32 C46.1 | IC11.2 125.04,196.32 119.4,196.32 | C48.1 120.13,193.42 119.4,194.16 C46.1 | v116.5,193.17 116.22,193.17 115.81,193.58 115.81,194.19 115.56,194.44 C47.1 115.08,193.78 114.95,193.65 114.37,193.65 114.27,193.75 IC13.23 | R65.2 R66.2 v123.05,189.06 123.05,187.68 | RN6.D2 122.29,181.76 122.65,182.12 122.65,182.55 | 122.65,182.55 122.65,183.34 | 122.65,183.34 122.65,184.13 | 123.05,185.3 123.05,186.13 | 123.05,186.13 123.05,186.9 | 123.05,186.9 123.05,187.68 | RN6.C2 122.65,182.56 122.65,182.55 | RN6.B2 122.63,183.36 122.65,183.34 | RN5.D2 123.03,185.31 123.05,185.3 | RN5.C2 123.03,186.12 123.05,186.13 | RN5.B2 123.03,186.91 123.05,186.9 | RN5.A2 123.02,187.72 123.05,187.68 | v225.54,45.46 C85.1 | C83.1 226.76,46.32 | 226.76,46.32 C85.1 | IC23.2 232.41,46.32 226.76,46.32